# EAGLE design tracker (EAGLE 9.5.2)

## Sheet 1 of 8: Power
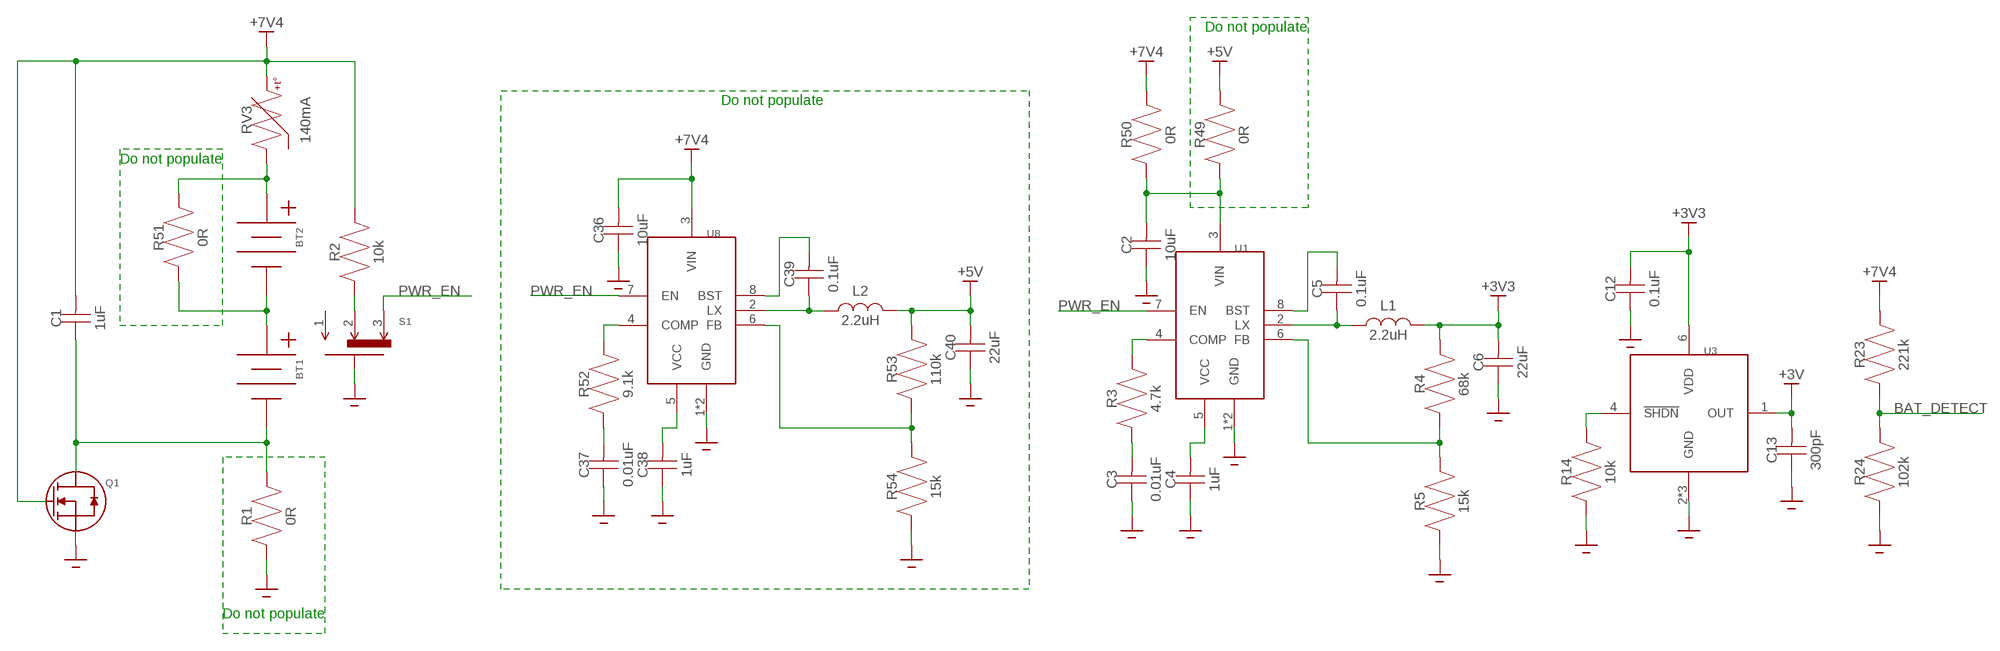
[diagram p0: schematic, sheet 1]

### Parts
BT1  18650  [18650]
BT2  18650  [18650]
C1  1uF  CAPACITOR0603  [0603]
C2  10uF  CAPACITOR0805  [0805]
C3  0.01uF  CAPACITOR0603  [0603]
C4  1uF  CAPACITOR0603  [0603]
C5  0.1uF  CAPACITOR0603  [0603]
C6  22uF  CAPACITOR0805  [0805]
C12  0.1uF  CAPACITOR0603  [0603]
C13  300pF  CAPACITOR0603  [0603]
C36  10uF  CAPACITOR0805  [0805]
C37  0.01uF  CAPACITOR0603  [0603]
C38  1uF  CAPACITOR0603  [0603]
C39  0.1uF  CAPACITOR0603  [0603]
C40  22uF  CAPACITOR0805  [0805]
L1  2.2uH  INDUCTOR0805  [0805]
L2  2.2uH  INDUCTOR0805  [0805]
Q1  DMG2302UK  [DMG2302UK]
R1  0R  RESISTOR0603  [0603]
R2  10k  RESISTOR0603  [0603]
R3  4.7k  RESISTOR0603  [0603]
R4  68k  RESISTOR0603  [0603]
R5  15k  RESISTOR0603  [0603]
R14  10k  RESISTOR0603  [0603]
R23  221k  RESISTOR0603  [0603]
R24  102k  RESISTOR0603  [0603]
R49  0R  RESISTOR0603  [0603]
R50  0R  RESISTOR0603  [0603]
R51  0R  RESISTOR0603  [0603]
R52  9.1k  RESISTOR0603  [0603]
R53  110k  RESISTOR0603  [0603]
R54  15k  RESISTOR0603  [0603]
RV3  140mA  PTC1812  [1812]
S1  OS102011MA1QN1  [OS102011MA1QN1]
U1  AOZ6662DI  [AOZ6662DI]
U3  MCP1501  [SOT95P280X145-6N]
U8  AOZ6662DI  [AOZ6662DI]

### Nets
+3V: C13.P$2 U3.1(OUT) ; also sheet 2
+3V3: C6.P$2 C12.P$2 L1.P$2 R4.P$2 U3.6(VDD) ; also sheet 2,3,4,5,6,7,8
+5V: C40.P$2 L2.P$2 R49.P$2 R53.P$2 ; also sheet 7
+7V4V: C1.P$2 C36.P$2 Q1.1(G) R2.P$2 R23.P$2 R50.P$2 RV3.P$2 U8.3(VIN) ; supply symbol labelled +7V4
BAT_DETECT: R23.P$1 R24.P$2 ; also sheet 2
GND: C2.P$1 C3.P$1 C4.P$1 C6.P$1 C12.P$1 C13.P$1 C36.P$1 C37.P$1 C38.P$1 C40.P$1 Q1.2(S) R1.P$1 R5.P$1 R14.P$1 R24.P$1 R54.P$1 S1.S1(GND) S1.S2(GND) U1.1(GND) U1.9(GND) U3.2(GND) U3.3(GND) U3.5(GND) U8.1(GND) U8.9(GND) ; also sheet 2,3,4,5,6,7,8
N$1: BT1.-1(-) BT1.-2(-) BT1.-3(-) C1.P$1 Q1.3(D) R1.P$2
N$3: R3.P$2 U1.4(COMP)
N$4: BT1.+1(+) BT1.+2(+) BT1.+3(+) BT2.-1(-) BT2.-2(-) BT2.-3(-) R51.P$1
N$5: C3.P$2 R3.P$1
N$6: C4.P$2 U1.5(VCC)
N$7: C5.P$2 U1.8(BST)
N$8: C5.P$1 L1.P$1 U1.2(LX)
N$9: R4.P$1 R5.P$2 U1.6(FB)
N$10: R2.P$1 S1.2
N$12: R14.P$2 U3.4(!SHDN)
N$50: R52.P$2 U8.4(COMP)
N$51: C2.P$2 R49.P$1 R50.P$1 U1.3(VIN)
N$52: C37.P$2 R52.P$1
N$53: C38.P$2 U8.5(VCC)
N$54: C39.P$2 U8.8(BST)
N$55: C39.P$1 L2.P$1 U8.2(LX)
N$56: R53.P$1 R54.P$2 U8.6(FB)
N$58: BT2.+1(+) BT2.+2(+) BT2.+3(+) R51.P$2 RV3.P$1
PWR_EN: S1.3 U1.7(EN) U8.7(EN)
Unconnected: S1.1

### Notes on the sheet
- Do not populate
- Do not populate
- Do not populate
- Do not populate

## Sheet 2 of 8: MCU
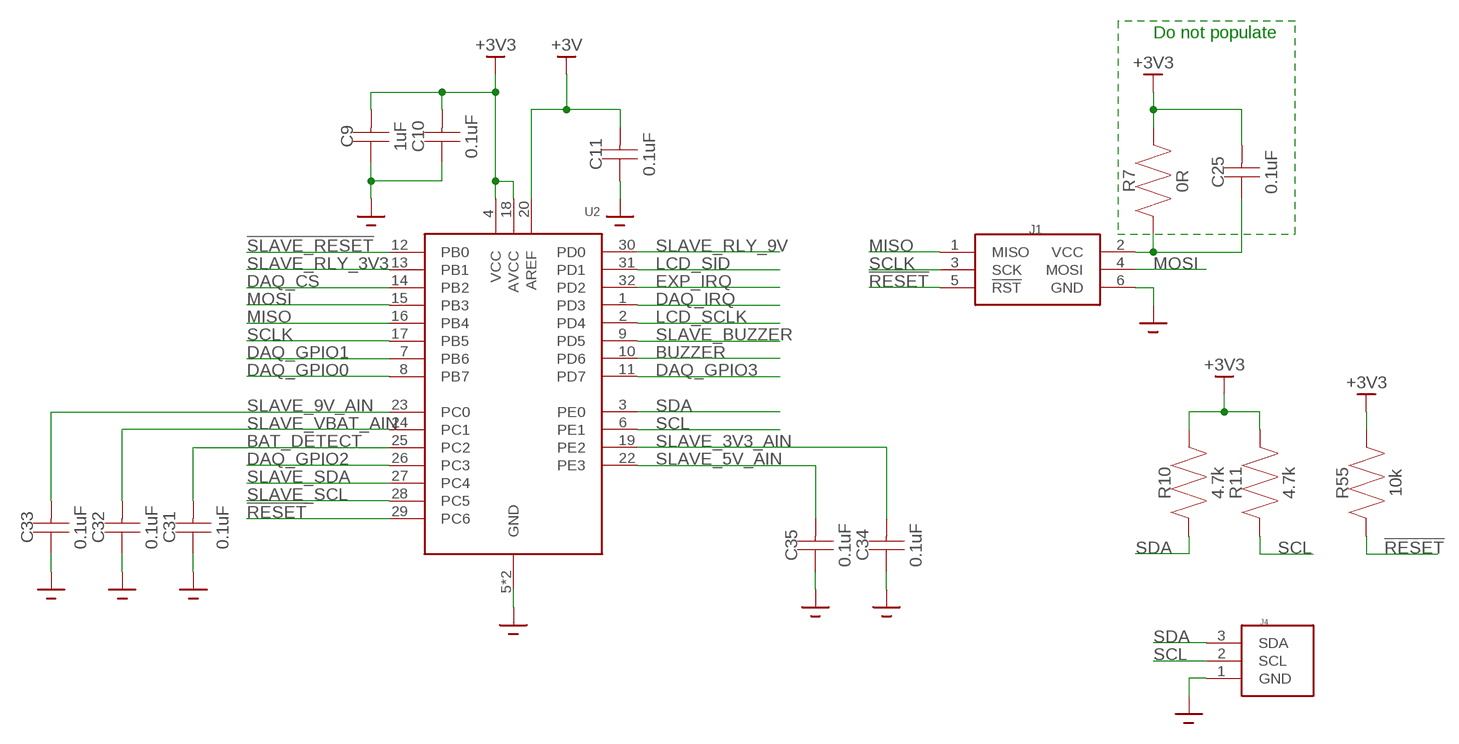
[diagram p1: schematic, sheet 2]

### Parts
C9  1uF  CAPACITOR0603  [0603]
C10  0.1uF  CAPACITOR0603  [0603]
C11  0.1uF  CAPACITOR0603  [0603]
C25  0.1uF  CAPACITOR0603  [0603]
C31  0.1uF  CAPACITOR0603  [0603]
C32  0.1uF  CAPACITOR0603  [0603]
C33  0.1uF  CAPACITOR0603  [0603]
C34  0.1uF  CAPACITOR0603  [0603]
C35  0.1uF  CAPACITOR0603  [0603]
J1  75869-131LF  [75869-131LF]
J4  640456-3  [640456-3]
R7  0R  RESISTOR0603  [0603]
R10  4.7k  RESISTOR0603  [0603]
R11  4.7k  RESISTOR0603  [0603]
R55  10k  RESISTOR0603  [0603]
U2  ATMEGA328PB32-TQFP  [ATMEGA328PB]

### Nets
!RESET: J1.5(!RST) R55.P$1 U2.29(PC6)
!SLAVE_RESET: U2.12(PB0) ; also sheet 3
+3V: C11.P$2 U2.20(AREF) ; also sheet 1
+3V3: C9.P$2 C10.P$2 C25.P$2 R7.P$2 R10.P$2 R11.P$2 R55.P$2 U2.4(VCC) U2.18(AVCC) ; also sheet 1,3,4,5,6,7,8
BAT_DETECT: C31.P$2 U2.25(PC2) ; also sheet 1
BUZZER: U2.10(PD6) ; also sheet 4
DAQ_CS: U2.14(PB2) ; also sheet 5
DAQ_GPIO0: U2.8(PB7) ; also sheet 5
DAQ_GPIO1: U2.7(PB6) ; also sheet 5
DAQ_GPIO2: U2.26(PC3) ; also sheet 5
DAQ_GPIO3: U2.11(PD7) ; also sheet 5
DAQ_IRQ: U2.1(PD3) ; also sheet 5
EXP_IRQ: U2.32(PD2) ; also sheet 6
GND: C9.P$1 C10.P$1 C11.P$1 C31.P$1 C32.P$1 C33.P$1 C34.P$1 C35.P$1 J1.6(GND) J4.1(GND) U2.5(GND) U2.21(GND) ; also sheet 1,3,4,5,6,7,8
LCD_SCLK: U2.2(PD4) ; also sheet 7
LCD_SID: U2.31(PD1) ; also sheet 7
MISO: J1.1(MISO) U2.16(PB4) ; also sheet 3,5
MOSI: J1.4(MOSI) U2.15(PB3) ; also sheet 5
N$14: C25.P$1 J1.2(VCC) R7.P$1
SCL: J4.2(SCL) R11.P$1 U2.6(PE1) ; also sheet 6,8
SCLK: J1.3(SCK) U2.17(PB5) ; also sheet 5
SDA: J4.3(SDA) R10.P$1 U2.3(PE0) ; also sheet 6,8
SLAVE_3V3_AIN: C34.P$2 U2.19(PE2) ; also sheet 3
SLAVE_5V_AIN: C35.P$2 U2.22(PE3) ; also sheet 3
SLAVE_9V_AIN: C33.P$2 U2.23(PC0) ; also sheet 3
SLAVE_BUZZER: U2.9(PD5) ; also sheet 3
SLAVE_RLY_3V3: U2.13(PB1) ; also sheet 3
SLAVE_RLY_9V: U2.30(PD0) ; also sheet 3
SLAVE_SCL: U2.28(PC5) ; also sheet 3
SLAVE_SDA: U2.27(PC4) ; also sheet 3
SLAVE_VBAT_AIN: C32.P$2 U2.24(PC1) ; also sheet 3

### Notes on the sheet
- Do not populate

## Sheet 3 of 8: Slave Port
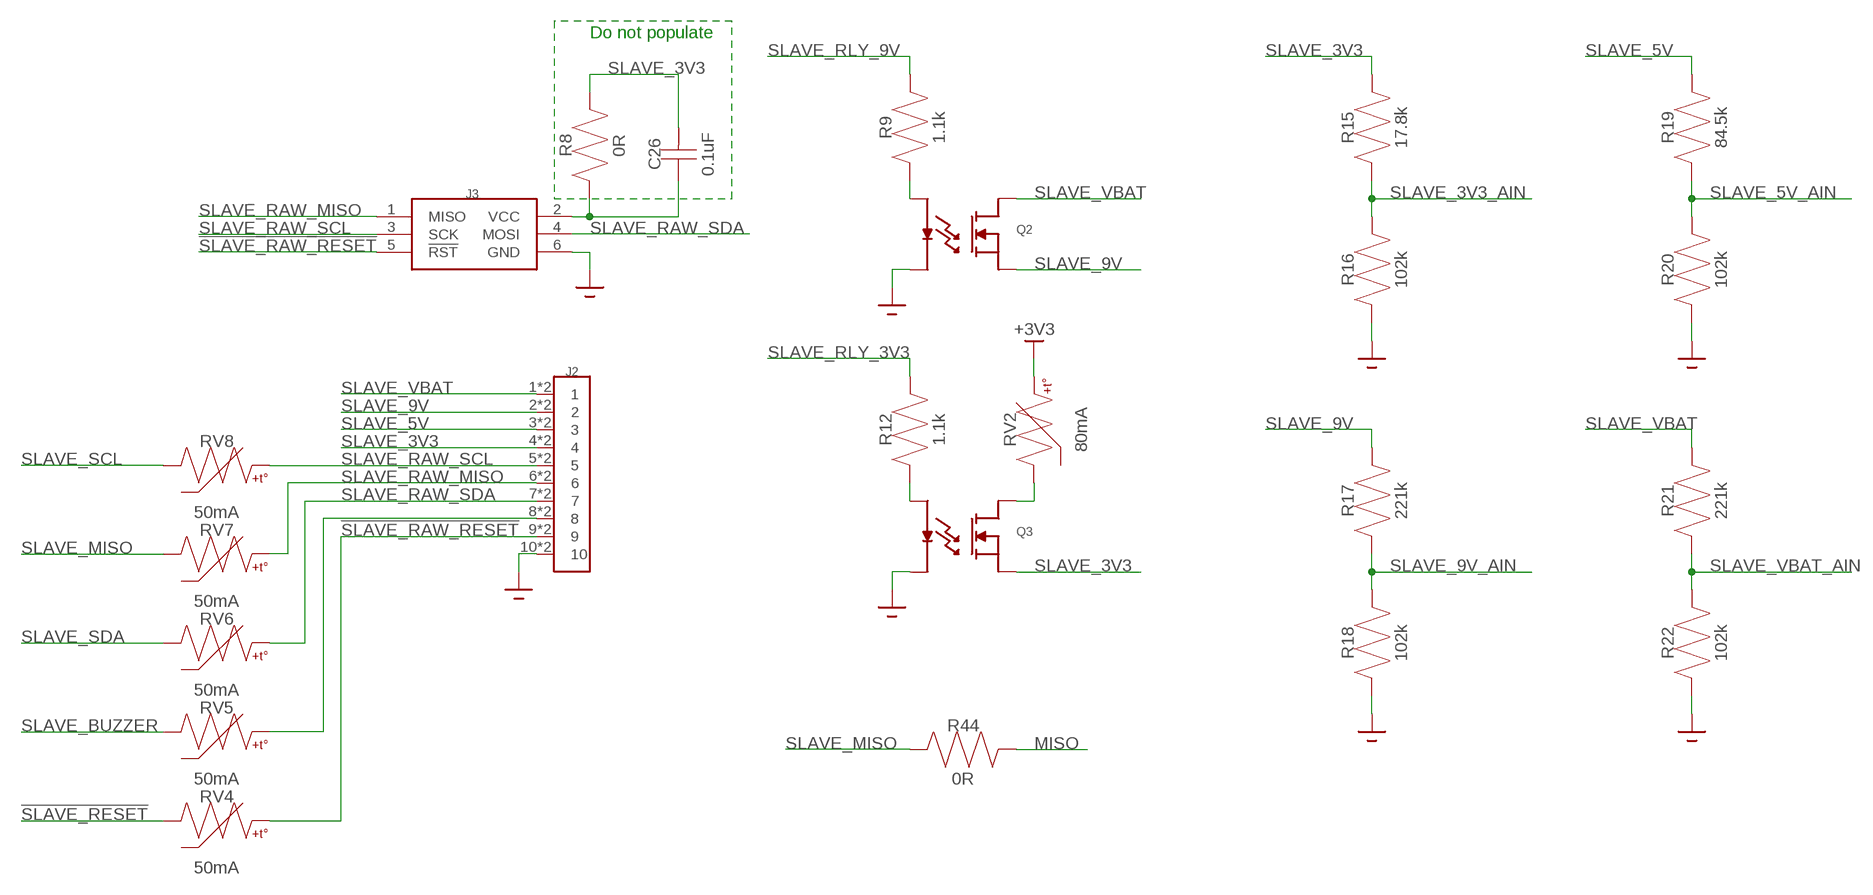
[diagram p2: schematic, sheet 3]

### Parts
C26  0.1uF  CAPACITOR0603  [0603]
J2  5-5530843-0FEMALE  [5-5530843-0]
J3  75869-131LF  [75869-131LF]
Q2  CPC1002N  [CPC1002N]
Q3  CPC1002N  [CPC1002N]
R8  0R  RESISTOR0603  [0603]
R9  1.1k  RESISTOR0603  [0603]
R12  1.1k  RESISTOR0603  [0603]
R15  17.8k  RESISTOR0603  [0603]
R16  102k  RESISTOR0603  [0603]
R17  221k  RESISTOR0603  [0603]
R18  102k  RESISTOR0603  [0603]
R19  84.5k  RESISTOR0603  [0603]
R20  102k  RESISTOR0603  [0603]
R21  221k  RESISTOR0603  [0603]
R22  102k  RESISTOR0603  [0603]
R44  0R  RESISTOR0603  [0603]
RV2  80mA  PTC0603  [0603]
RV4  50mA  PTC0603  [0603]
RV5  50mA  PTC0603  [0603]
RV6  50mA  PTC0603  [0603]
RV7  50mA  PTC0603  [0603]
RV8  50mA  PTC0603  [0603]

### Nets
!SLAVE_RAW_RESET: J2.9 J2.19 J3.5(!RST) RV4.P$2
!SLAVE_RESET: RV4.P$1 ; also sheet 2
+3V3: RV2.P$2 ; also sheet 1,2,4,5,6,7,8
GND: J2.10 J2.20 J3.6(GND) Q2.2(C-) Q3.2(C-) R16.P$1 R18.P$1 R20.P$1 R22.P$1 ; also sheet 1,2,4,5,6,7,8
MISO: R44.P$2 ; also sheet 2,5
N$2: Q3.4(DC+) RV2.P$1
N$19: C26.P$1 J3.2(VCC) R8.P$1
N$20: Q3.1(C+) R12.P$1
N$26: Q2.1(C+) R9.P$1
N$64: J2.8 J2.18 RV5.P$2
SLAVE_3V3: C26.P$2 J2.4 J2.14 Q3.3(DC-) R8.P$2 R15.P$2
SLAVE_3V3_AIN: R15.P$1 R16.P$2 ; also sheet 2
SLAVE_5V: J2.3 J2.13 R19.P$2
SLAVE_5V_AIN: R19.P$1 R20.P$2 ; also sheet 2
SLAVE_9V: J2.2 J2.12 Q2.3(DC-) R17.P$2
SLAVE_9V_AIN: R17.P$1 R18.P$2 ; also sheet 2
SLAVE_BUZZER: RV5.P$1 ; also sheet 2
SLAVE_MISO: R44.P$1 RV7.P$1
SLAVE_RAW_MISO: J2.6 J2.16 J3.1(MISO) RV7.P$2
SLAVE_RAW_SCL: J2.5 J2.15 J3.3(SCK) RV8.P$2
SLAVE_RAW_SDA: J2.7 J2.17 J3.4(MOSI) RV6.P$2
SLAVE_RLY_3V3: R12.P$2 ; also sheet 2
SLAVE_RLY_9V: R9.P$2 ; also sheet 2
SLAVE_SCL: RV8.P$1 ; also sheet 2
SLAVE_SDA: RV6.P$1 ; also sheet 2
SLAVE_VBAT: J2.1 J2.11 Q2.4(DC+) R21.P$2
SLAVE_VBAT_AIN: R21.P$1 R22.P$2 ; also sheet 2

### Notes on the sheet
- Do not populate

## Sheet 4 of 8: Buzzer and LEDs
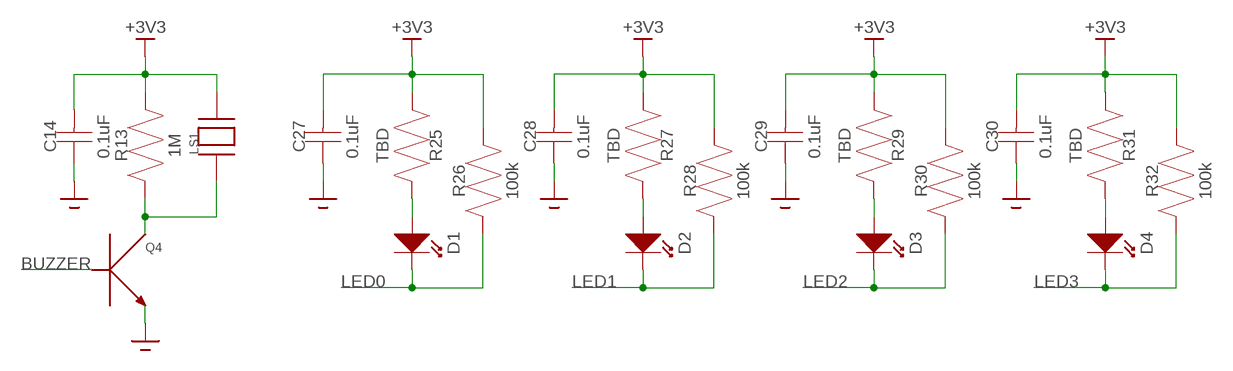
[diagram p3: schematic, sheet 4]

### Parts
C14  0.1uF  CAPACITOR0603  [0603]
C27  0.1uF  CAPACITOR0603  [0603]
C28  0.1uF  CAPACITOR0603  [0603]
C29  0.1uF  CAPACITOR0603  [0603]
C30  0.1uF  CAPACITOR0603  [0603]
D1  LED  [0805]
D2  LED  [0805]
D3  LED  [0805]
D4  LED  [0805]
LS1  AT-1224-TWT-5V-2-R  [AT-1224-TWT-5V-2-R]
Q4  MMBT3904  [MMBT3904]
R13  1M  RESISTOR0603  [0603]
R25  TBD  RESISTOR0603  [0603]
R26  100k  RESISTOR0603  [0603]
R27  TBD  RESISTOR0603  [0603]
R28  100k  RESISTOR0603  [0603]
R29  TBD  RESISTOR0603  [0603]
R30  100k  RESISTOR0603  [0603]
R31  TBD  RESISTOR0603  [0603]
R32  100k  RESISTOR0603  [0603]

### Nets
+3V3: C14.P$2 C27.P$2 C28.P$2 C29.P$2 C30.P$2 LS1.2 R13.P$2 R25.P$1 R26.P$2 R27.P$1 R28.P$2 R29.P$1 R30.P$2 R31.P$1 R32.P$2 ; also sheet 1,2,3,5,6,7,8
BUZZER: Q4.1(B) ; also sheet 2
GND: C14.P$1 C27.P$1 C28.P$1 C29.P$1 C30.P$1 Q4.2(E) ; also sheet 1,2,3,5,6,7,8
LED0: D1.P$2(OUT) R26.P$1 ; also sheet 6
LED1: D2.P$2(OUT) R28.P$1 ; also sheet 6
LED2: D3.P$2(OUT) R30.P$1 ; also sheet 6
LED3: D4.P$2(OUT) R32.P$1 ; also sheet 6
N$13: D2.P$1(IN) R27.P$2
N$15: D3.P$1(IN) R29.P$2
N$16: D1.P$1(IN) R25.P$2
N$17: D4.P$1(IN) R31.P$2
N$27: LS1.1 Q4.3(C) R13.P$1

## Sheet 5 of 8: RF
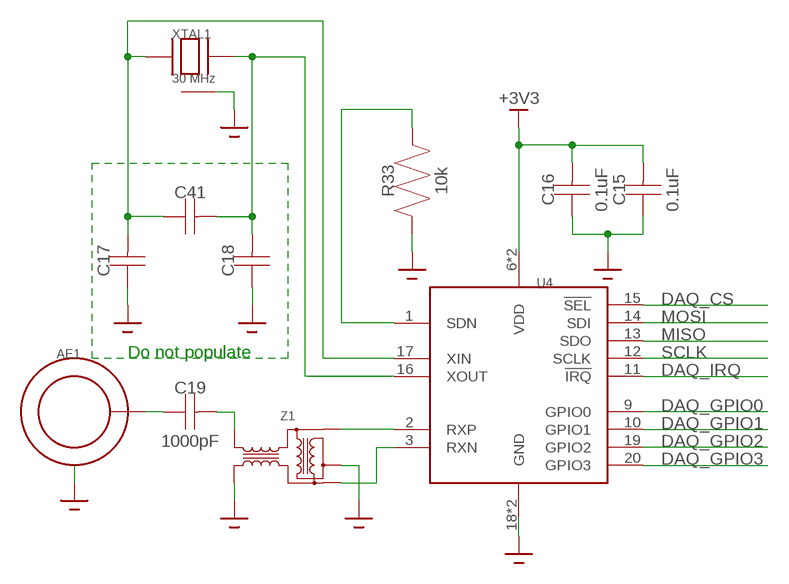
[diagram p4: schematic, sheet 5]

### Parts
AE1  CON-SMA-EDGE-S  [CON-SMA-EDGE-S]
C15  0.1uF  CAPACITOR0603  [0603]
C16  0.1uF  CAPACITOR0603  [0603]
C17  CAPACITOR0603  [0603]
C18  CAPACITOR0603  [0603]
C19  1000pF  CAPACITOR0402  [0402]
C41  CAPACITOR0603  [0603]
R33  10k  RESISTOR0603  [0603]
U4  SI4362  [SI4362]
XTAL1  30 MHz  RH100  [RH100]
Z1  TC1-1T-152X+  [TC1-1T-152X+]

### Nets
+3V3: C15.P$2 C16.P$2 U4.6(VDD) U4.8(VDD) ; also sheet 1,2,3,4,6,7,8
DAQ_CS: U4.15(!SEL) ; also sheet 2
DAQ_GPIO0: U4.9(GPIO0) ; also sheet 2
DAQ_GPIO1: U4.10(GPIO1) ; also sheet 2
DAQ_GPIO2: U4.19(GPIO2) ; also sheet 2
DAQ_GPIO3: U4.20(GPIO3) ; also sheet 2
DAQ_IRQ: U4.11(!IRQ) ; also sheet 2
GND: AE1.GND1(GND) AE1.GND2(GND) AE1.GND3(GND) AE1.GND4(GND) C15.P$1 C16.P$1 C17.P$1 C18.P$1 R33.P$1 U4.18(GND) U4.21(GND) XTAL1.1(GND) XTAL1.3(GND) Z1.2(CENTER) Z1.4(GND) ; also sheet 1,2,3,4,6,7,8
MISO: U4.13(SDO) ; also sheet 2,3
MOSI: U4.14(SDI) ; also sheet 2
N$18: R33.P$2 U4.1(SDN)
N$21: AE1.CENTER(OUT) C19.1
N$23: C17.P$2 C41.P$1 U4.17(XIN) XTAL1.2
N$24: U4.3(RXN) Z1.3(BAL2)
N$25: U4.2(RXP) Z1.1(BAL1)
N$28: C18.P$2 C41.P$2 U4.16(XOUT) XTAL1.4
N$29: C19.2 Z1.6(UNBAL)
SCLK: U4.12(SCLK) ; also sheet 2

### Notes on the sheet
- Do not populate

## Sheet 6 of 8: Pin Pad
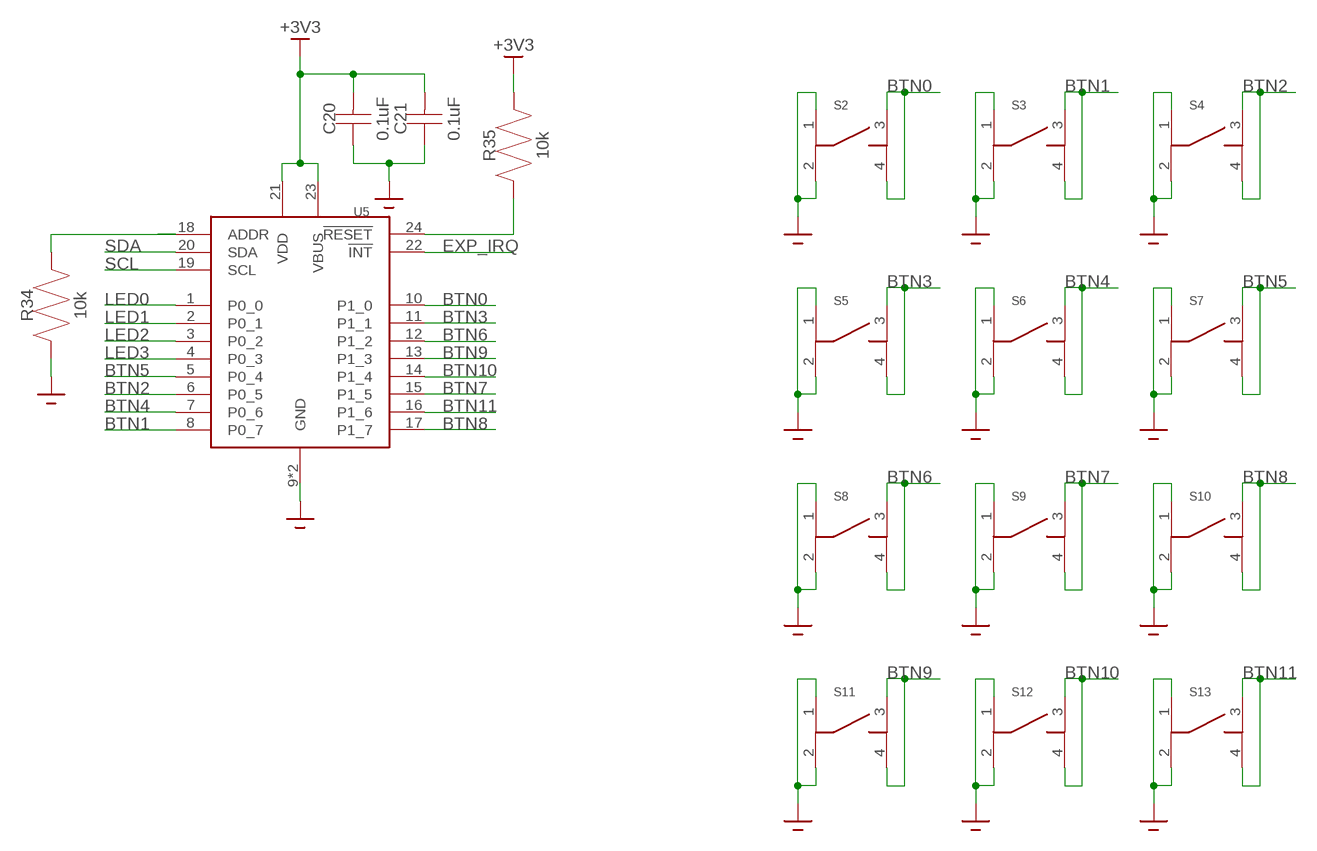
[diagram p5: schematic, sheet 6]

### Parts
C20  0.1uF  CAPACITOR0603  [0603]
C21  0.1uF  CAPACITOR0603  [0603]
R34  10k  RESISTOR0603  [0603]
R35  10k  RESISTOR0603  [0603]
S2  3-1825910  [3-1825910]
S3  3-1825910  [3-1825910]
S4  3-1825910  [3-1825910]
S5  3-1825910  [3-1825910]
S6  3-1825910  [3-1825910]
S7  3-1825910  [3-1825910]
S8  3-1825910  [3-1825910]
S9  3-1825910  [3-1825910]
S10  3-1825910  [3-1825910]
S11  3-1825910  [3-1825910]
S12  3-1825910  [3-1825910]
S13  3-1825910  [3-1825910]
U5  PCAL6416  [PCAL6416]

### Nets
+3V3: C20.P$2 C21.P$2 R35.P$2 U5.21(VDD) U5.23(VBUS) ; also sheet 1,2,3,4,5,7,8
BTN0: S2.3 S2.4 U5.10(P1_0)
BTN1: S3.3 S3.4 U5.8(P0_7)
BTN2: S4.3 S4.4 U5.6(P0_5)
BTN3: S5.3 S5.4 U5.11(P1_1)
BTN4: S6.3 S6.4 U5.7(P0_6)
BTN5: S7.3 S7.4 U5.5(P0_4)
BTN6: S8.3 S8.4 U5.12(P1_2)
BTN7: S9.3 S9.4 U5.15(P1_5)
BTN8: S10.3 S10.4 U5.17(P1_7)
BTN9: S11.3 S11.4 U5.13(P1_3)
BTN10: S12.3 S12.4 U5.14(P1_4)
BTN11: S13.3 S13.4 U5.16(P1_6)
EXP_IRQ: U5.22(!INT) ; also sheet 2
GND: C20.P$1 C21.P$1 R34.P$1 S2.1 S2.2 S3.1 S3.2 S4.1 S4.2 S5.1 S5.2 S6.1 S6.2 S7.1 S7.2 S8.1 S8.2 S9.1 S9.2 S10.1 S10.2 S11.1 S11.2 S12.1 S12.2 S13.1 S13.2 U5.9(GND) U5.25(GND) ; also sheet 1,2,3,4,5,7,8
LED0: U5.1(P0_0) ; also sheet 4
LED1: U5.2(P0_1) ; also sheet 4
LED2: U5.3(P0_2) ; also sheet 4
LED3: U5.4(P0_3) ; also sheet 4
N$30: R35.P$1 U5.24(!RESET)
N$32: R34.P$2 U5.18(ADDR)
SCL: U5.19(SCL) ; also sheet 2,8
SDA: U5.20(SDA) ; also sheet 2,8

## Sheet 7 of 8: LCD
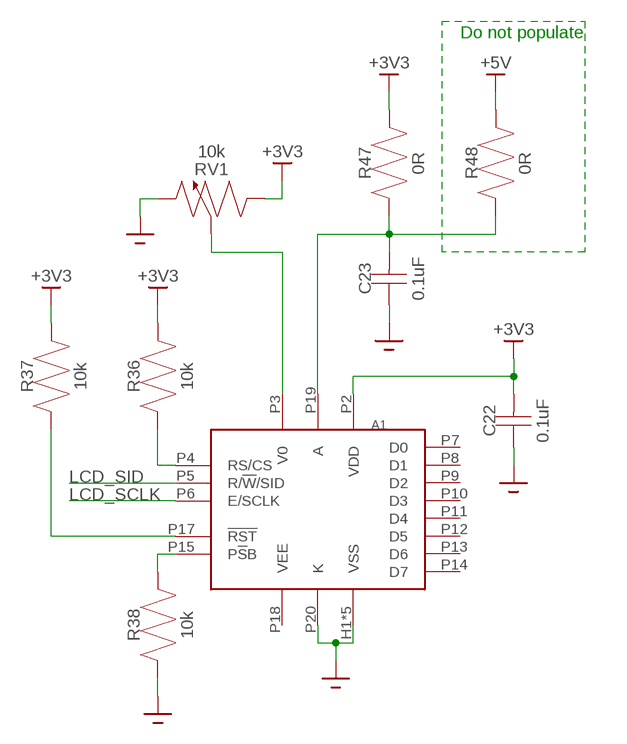
[diagram p6: schematic, sheet 7]

### Parts
A1  LCD12864  [LCD12864]
C22  0.1uF  CAPACITOR0603  [0603]
C23  0.1uF  CAPACITOR0603  [0603]
R36  10k  RESISTOR0603  [0603]
R37  10k  RESISTOR0603  [0603]
R38  10k  RESISTOR0603  [0603]
R47  0R  RESISTOR0603  [0603]
R48  0R  RESISTOR0603  [0603]
RV1  10k  TC33X-2  [TC33X-2]

### Nets
+3V3: A1.P2(VDD) C22.P$2 R36.P$2 R37.P$2 R47.P$2 RV1.1(CCW) ; also sheet 1,2,3,4,5,6,8
+5V: R48.P$2 ; also sheet 1
GND: A1.H1(VSS) A1.H2(VSS) A1.H3(VSS) A1.H4(VSS) A1.P1(VSS) A1.P20(K) C22.P$1 C23.P$1 R38.P$1 RV1.3(CW) ; also sheet 1,2,3,4,5,6,8
LCD_SCLK: A1.P6(E/SCLK) ; also sheet 2
LCD_SID: A1.P5(R/!W!/SID) ; also sheet 2
N$22: A1.P4(RS/CS) R36.P$1
N$31: A1.P17(!RST) R37.P$1
N$33: A1.P15(P!S!B) R38.P$2
N$35: A1.P3(V0) RV1.2(WIPER)
N$43: A1.P19(A) C23.P$2 R47.P$1 R48.P$1
Unconnected: A1.P7(D0) A1.P8(D1) A1.P9(D2) A1.P10(D3) A1.P11(D4) A1.P12(D5) A1.P13(D6) A1.P14(D7)

### Notes on the sheet
- Do not populate

## Sheet 8 of 8: EEPROM
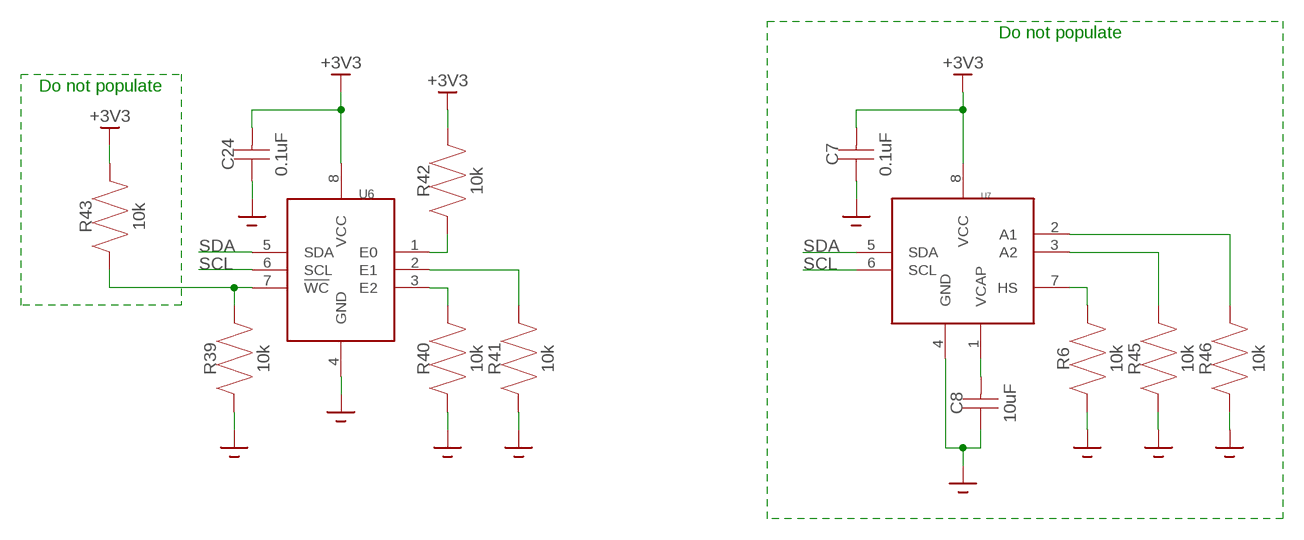
[diagram p7: schematic, sheet 8]

### Parts
C7  0.1uF  CAPACITOR0603  [0603]
C8  10uF  CAPACITOR0805  [0805]
C24  0.1uF  CAPACITOR0603  [0603]
R6  10k  RESISTOR0603  [0603]
R39  10k  RESISTOR0603  [0603]
R40  10k  RESISTOR0603  [0603]
R41  10k  RESISTOR0603  [0603]
R42  10k  RESISTOR0603  [0603]
R43  10k  RESISTOR0603  [0603]
R45  10k  RESISTOR0603  [0603]
R46  10k  RESISTOR0603  [0603]
U6  M24  [M24]
U7  47L16  [47L16]

### Nets
+3V3: C7.P$2 C24.P$2 R42.P$2 R43.P$2 U6.8(VCC) U7.8(VCC) ; also sheet 1,2,3,4,5,6,7
GND: C7.P$1 C8.P$1 C24.P$1 R6.P$1 R39.P$1 R40.P$1 R41.P$1 R45.P$1 R46.P$1 U6.4(GND) U7.4(GND) ; also sheet 1,2,3,4,5,6,7
N$11: R42.P$1 U6.1(E0)
N$34: R39.P$2 R43.P$1 U6.7(!WC)
N$36: R40.P$2 U6.3(E2)
N$37: R41.P$2 U6.2(E1)
N$38: R6.P$2 U7.7(HS)
N$44: C8.P$2 U7.1(VCAP)
N$45: R45.P$2 U7.3(A2)
N$46: R46.P$2 U7.2(A1)
SCL: U6.6(SCL) U7.6(SCL) ; also sheet 2,6
SDA: U6.5(SDA) U7.5(SDA) ; also sheet 2,6

### Notes on the sheet
- Do not populate
- Do not populate

## Power pins joined to a net without a drawn wire
VEE: A1.P18(VEE)

## Library data of the parts
A1 = radio-tracker:LCD12864
AE1 = radio-tracker:CON-SMA-EDGE-S
BT1 BT2 = radio-tracker:18650
C1-C41 = radio-tracker:CAPACITOR
D1-D4 = radio-tracker:LED
J1 J3 = radio-tracker:75869-131LF
J2 = radio-tracker:5-5530843-0
J4 = radio-tracker:640456-3
L1 L2 = radio-tracker:INDUCTOR
LS1 = radio-tracker:AT-1224-TWT-5V-2-R
Q1 = radio-tracker:DMG2302UK
Q2 Q3 = radio-tracker:CPC1002N
Q4 = radio-tracker:MMBT3904
R1-R55 = radio-tracker:RESISTOR
RV1 = radio-tracker:TC33X-2
RV2-RV8 = radio-tracker:PTC
S1 = radio-tracker:OS102011MA1QN1
S2-S13 = radio-tracker:3-1825910
U1 U8 = radio-tracker:AOZ6662DI
U2 = radio-tracker:ATMEGA328PB
U3 = radio-tracker:MCP1501
U4 = radio-tracker:SI4362
U5 = radio-tracker:PCAL6416
U6 = radio-tracker:M24
U7 = radio-tracker:47L16
XTAL1 = radio-tracker:RH100
Z1 = radio-tracker:TC1-1T-152X+

## Board
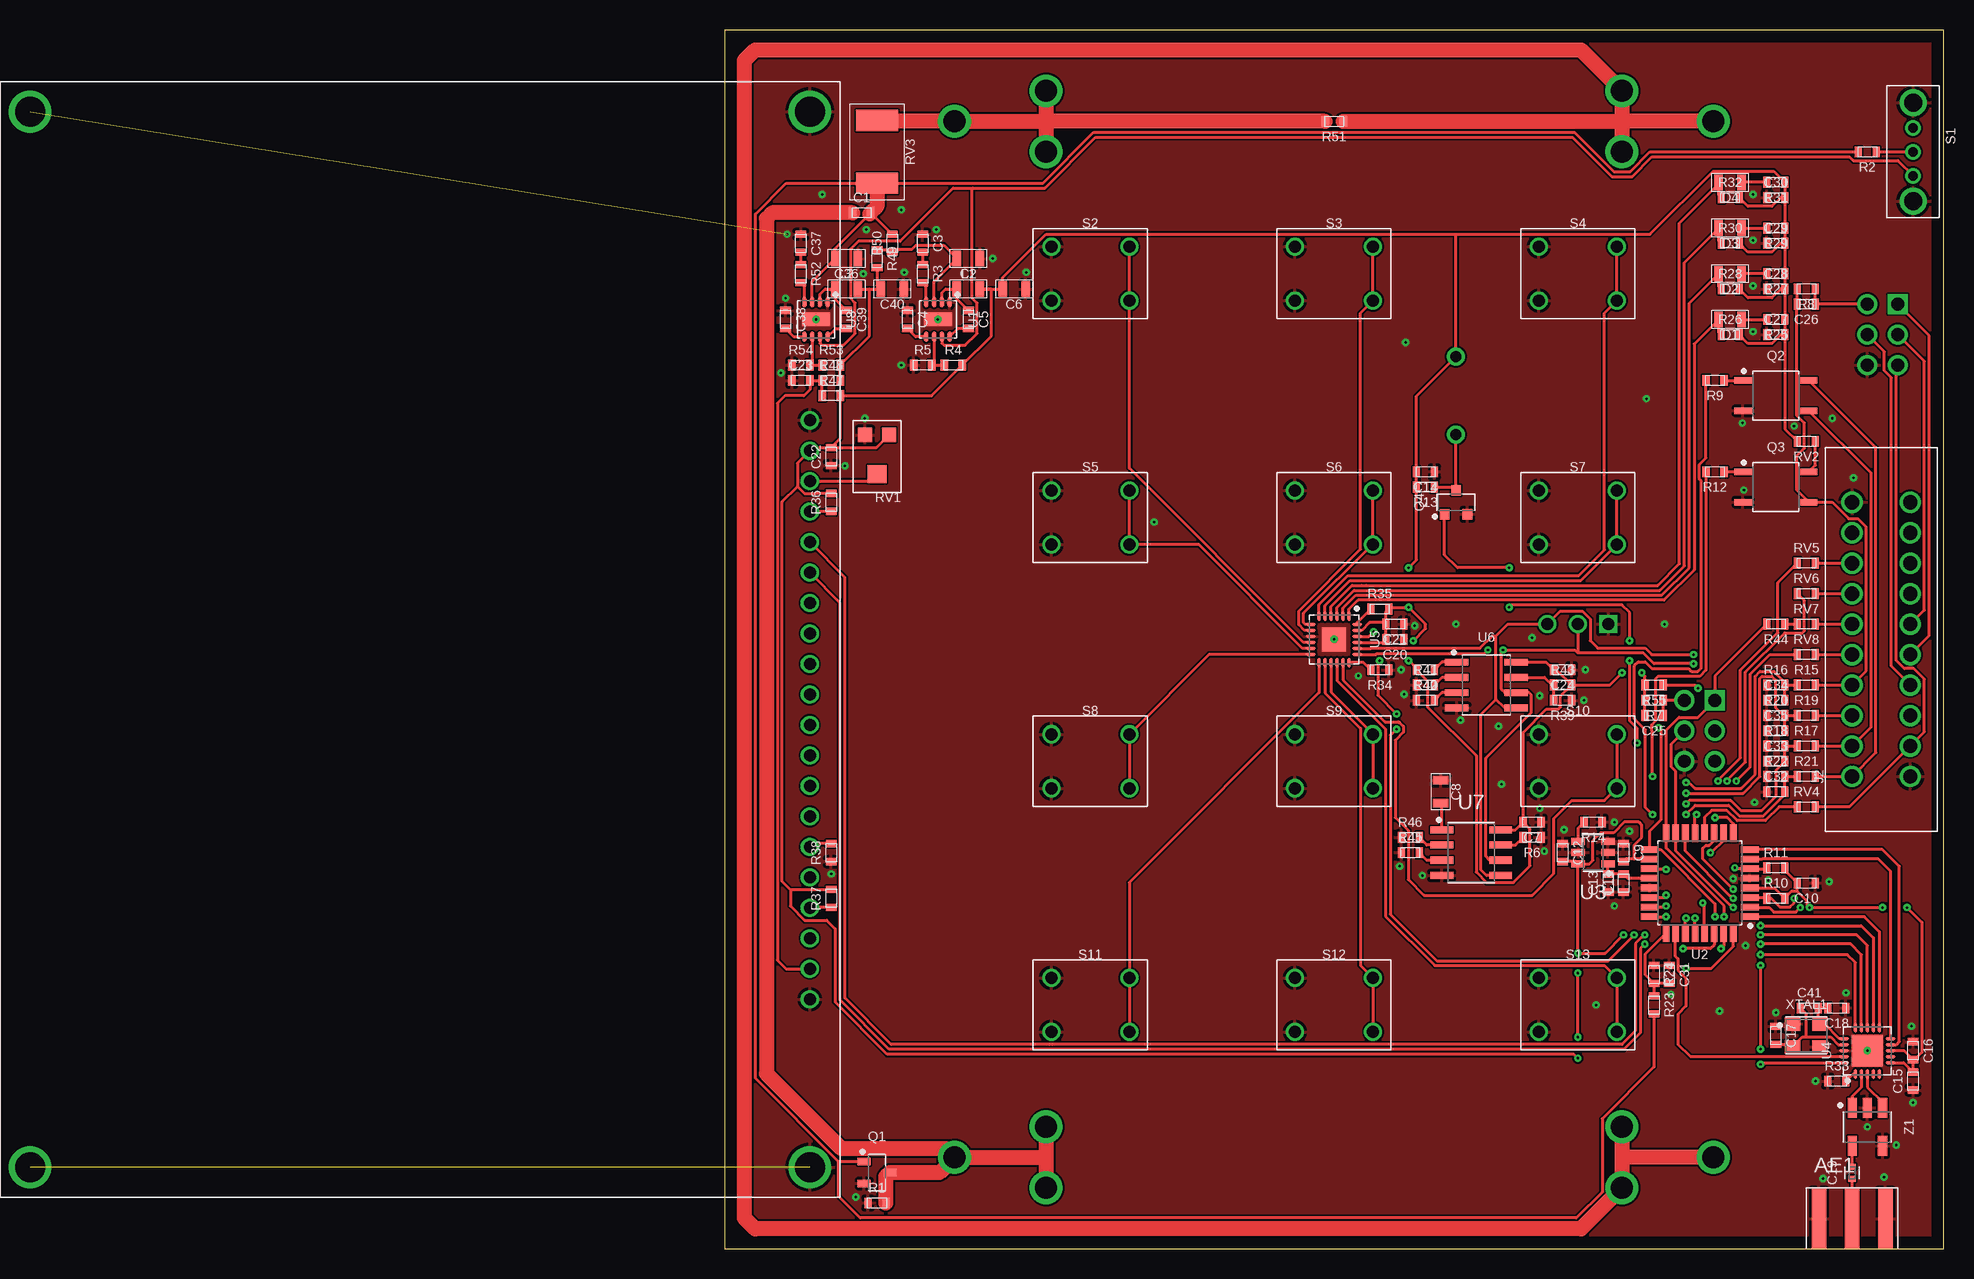
[diagram p8: board, top side]
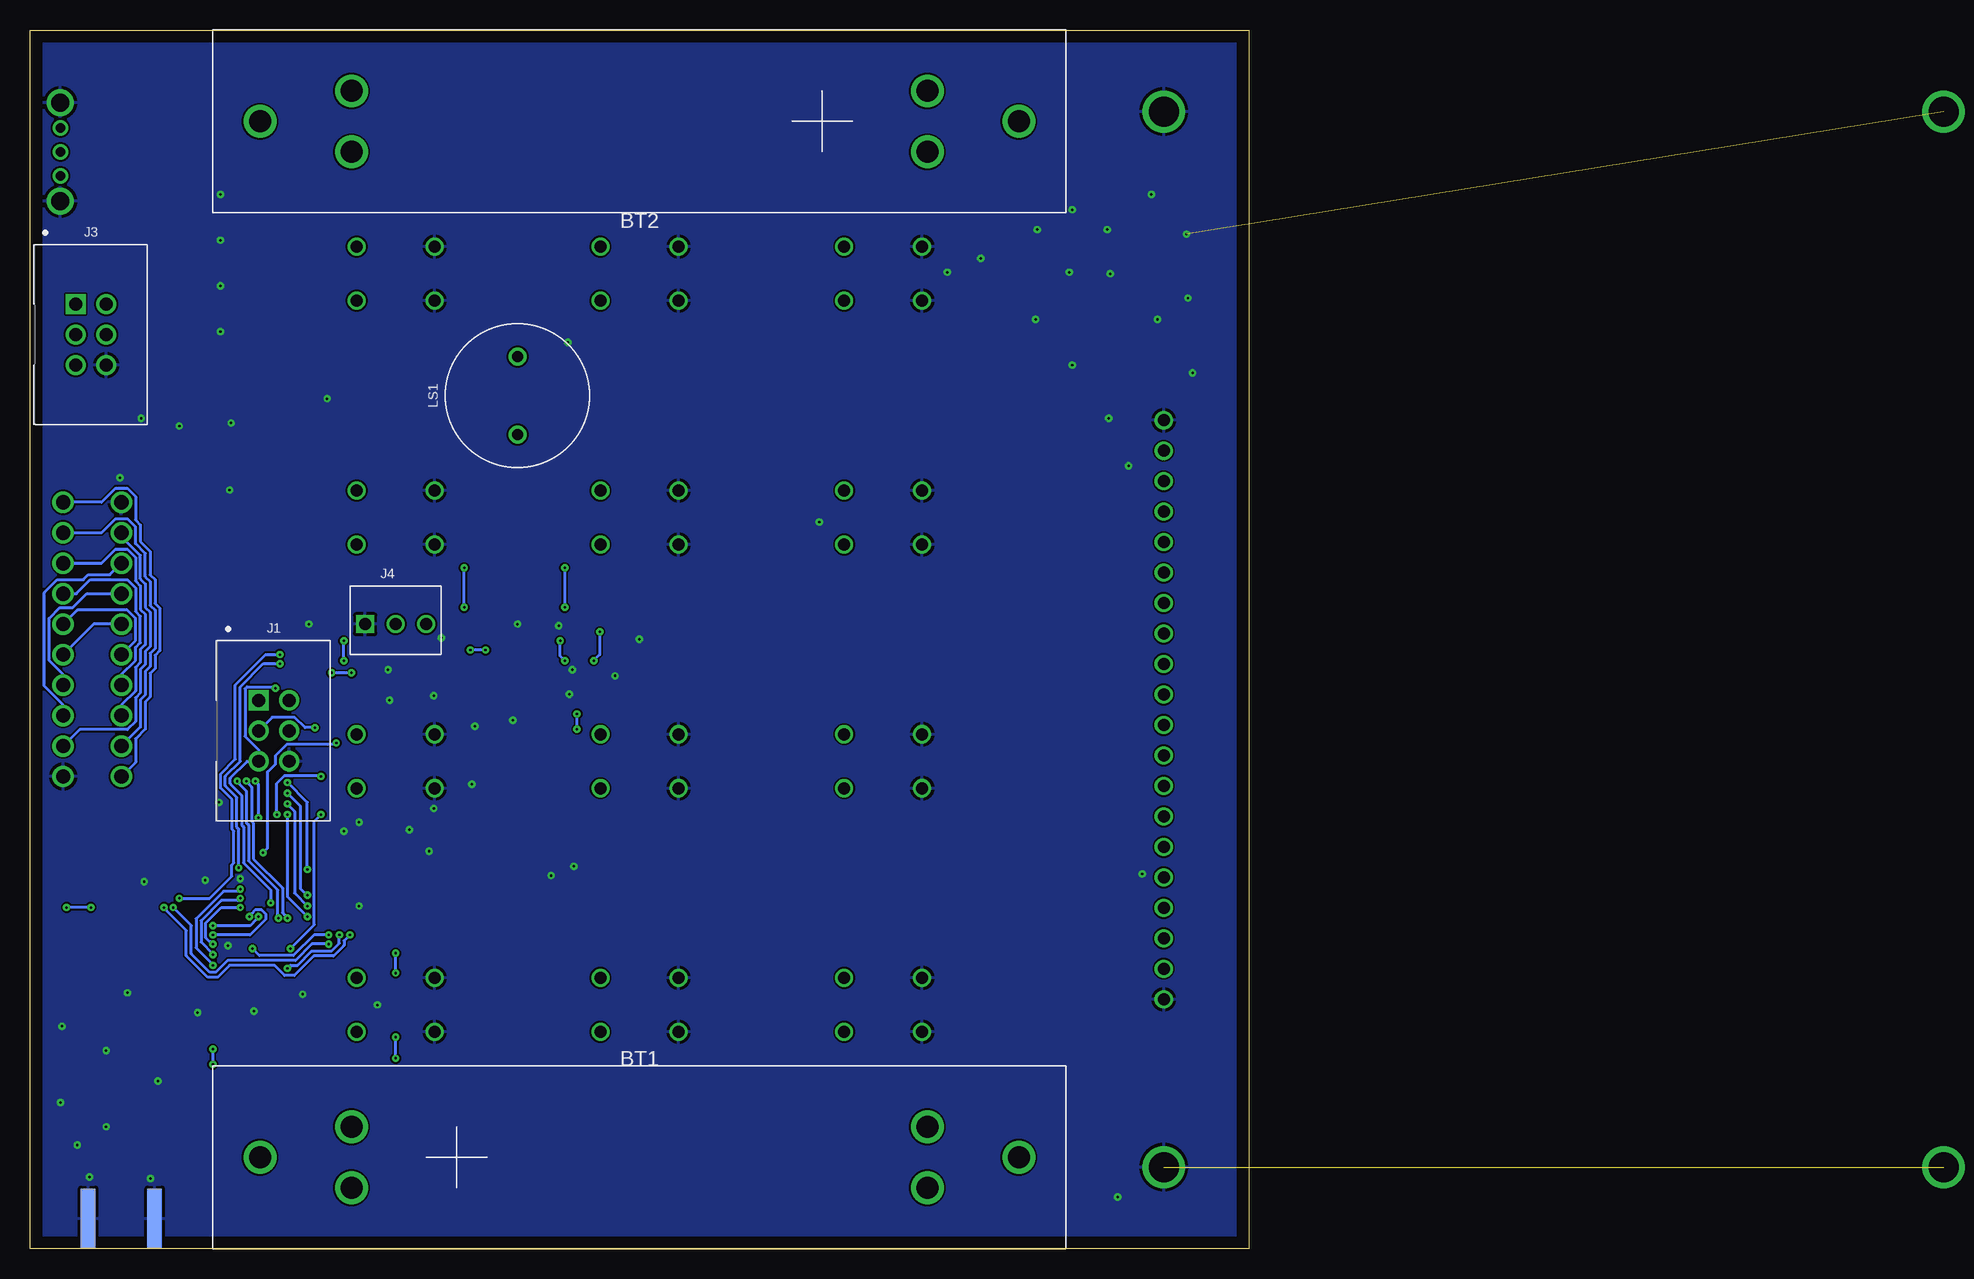
[diagram p9: board, bottom side, seen from below]

Size 101.6 x 101.6 mm. Coordinates in mm from the lower left corner, seen from the top.
Outline: 0,0 101.6,0 101.6,101.6 0,101.6 0,0
Copper layers (1*16): Top 0.035mm / dielectric 1.5mm / Bottom 0.035mm
Design rules "default *": minimum track width 6mil, minimum drill 0.2mm, track to track 6mil, track to pad 6mil, pad to pad 6mil, via to via 6mil, smd to smd 6mil, copper to edge 40mil, drill to drill 6mil, minimum pad ring 10mil, minimum via ring 8mil, stop-mask expansion 4mil, vias tented up to drill 0mil, thermal gap 10mil

### Footprints (pad centres in the part's own frame; a part is rotated, then mirrored left to right if it is on the bottom)
LCD12864 = drill 2.5: H1 -44,32.5; H2 44,32.5; H3 -44,-32.5; H4 44,-32.5 | drill 1: P1 18.26,-32.5; P2 15.72,-32.5; P3 13.18,-32.5; P4 10.64,-32.5; P5 8.1,-32.5; P6 5.56,-32.5; P7 3.02,-32.5; P8 0.48,-32.5; P9 -2.06,-32.5; P10 -4.6,-32.5; P11 -7.14,-32.5; P12 -9.68,-32.5; P13 -12.22,-32.5; P14 -14.76,-32.5; P15 -17.3,-32.5; P16 -19.84,-32.5; P17 -22.38,-32.5; P18 -24.92,-32.5; P19 -27.46,-32.5; P20 -30,-32.5
CON-SMA-EDGE-S = smd 5 x 1.2: CENTER -2.5,0; GND1 -2.5,2.77; GND2 -2.5,-2.77 | smd 5 x 1.2 bottom: GND3 -2.5,2.77; GND4 -2.5,-2.77
18650 = drill 1.829: +1 -24.003,2.54; +2 -24.003,-2.54; +3 -31.623,0; -1 24.003,2.54; -2 24.003,-2.54; -3 31.623,0
0603 = smd 0.6 x 0.9: P$1 -0.75,0; P$2 0.75,0
0805 = smd 0.711 x 1.295: P$1 -0.953,0; P$2 0.953,0
0402 = smd 0.5 x 0.6: 1 -0.5,0; 2 0.5,0
75869-131LF = drill 1.077 pad 1.677 square: 1 -1.27,2.54 | drill 1.077 pad 1.677: 2 1.27,2.54; 3 -1.27,0; 4 1.27,0; 5 -1.27,-2.54; 6 1.27,-2.54
5-5530843-0 = drill 1.19 pad 1.79: 1 0,0; 2 2.54,0; 3 5.08,0; 4 7.62,0; 5 10.16,0; 6 12.7,0; 7 15.24,0; 8 17.78,0; 9 20.32,0; 10 22.86,0; 11 22.86,-4.85; 12 20.32,-4.85; 13 17.78,-4.85; 14 15.24,-4.85; 15 12.7,-4.85; 16 10.16,-4.85; 17 7.62,-4.85; 18 5.08,-4.85; 19 2.54,-4.85; 20 0,-4.85
640456-3 = drill 1 square: 1 -2.54,0 | drill 1: 2 0,0; 3 2.54,0
AT-1224-TWT-5V-2-R = drill 0.9 pad 1.5: 1 -3.25,0; 2 3.25,0
DMG2302UK = smd 1.088 x 0.609: 1 -1.07,0.915; 2 -1.07,-0.915; 3 1.07,0
CPC1002N = smd 1.435 x 0.538: 1 -2.746,1.27; 2 -2.746,-1.27; 3 2.746,-1.27; 4 2.746,1.27
MMBT3904 = smd 0.9 x 0.8: 1 -1,0.95; 2 -1,-0.95; 3 1,0
TC33X-2 = smd 1.2 x 1.2: 1 -1,-1.8; 3 1,-1.8 | smd 1.6 x 1.5: 2 0,1.45
1812 = smd 1.78 x 3.5: P$1 -2.615,0; P$2 2.615,0
OS102011MA1QN1 = drill 0.8: 1 -2,0; 2 0,0; 3 2,0 | drill 1.5: S1 -4.1,0; S2 4.1,0
3-1825910 = drill 1: 1 -3.25,2.25; 2 -3.25,-2.25; 3 3.25,2.25; 4 3.25,-2.25
AOZ6662DI = smd 0.86 x 0.317: 1 -1.435,0.975; 2 -1.435,0.325; 3 -1.435,-0.325; 4 -1.435,-0.975; 5 1.435,-0.975; 6 1.435,-0.325; 7 1.435,0.325; 8 1.435,0.975 | smd 1.15 x 2.35: 9 0,0
ATMEGA328PB = smd 1.469 x 0.547: 1 -4.171,2.8; 2 -4.171,2; 3 -4.171,1.2; 4 -4.171,0.4; 5 -4.171,-0.4; 6 -4.171,-1.2; 7 -4.171,-2; 8 -4.171,-2.8; 17 4.171,-2.8; 18 4.171,-2; 19 4.171,-1.2; 20 4.171,-0.4; 21 4.171,0.4; 22 4.171,1.2; 23 4.171,2; 24 4.171,2.8 | smd 0.547 x 1.469: 9 -2.8,-4.171; 10 -2,-4.171; 11 -1.2,-4.171; 12 -0.4,-4.171; 13 0.4,-4.171; 14 1.2,-4.171; 15 2,-4.171; 16 2.8,-4.171; 25 2.8,4.171; 26 2,4.171; 27 1.2,4.171; 28 0.4,4.171; 29 -0.4,4.171; 30 -1.2,4.171; 31 -2,4.171; 32 -2.8,4.171
SOT95P280X145-6N = smd 1.119 x 0.59: 1 -1.246,0.95; 2 -1.246,0; 3 -1.246,-0.95; 4 1.246,-0.95; 5 1.246,0; 6 1.246,0.95
SI4362 = smd 0.837 x 0.264: 1 -1.937,1; 2 -1.937,0.5; 3 -1.937,0; 4 -1.937,-0.5; 5 -1.937,-1; 11 1.937,-1; 12 1.937,-0.5; 13 1.937,0; 14 1.937,0.5; 15 1.937,1 | smd 0.264 x 0.837: 6 -1,-1.937; 7 -0.5,-1.937; 8 0,-1.937; 9 0.5,-1.937; 10 1,-1.937; 16 1,1.937; 17 0.5,1.937; 18 0,1.937; 19 -0.5,1.937; 20 -1,1.937 | smd 2.6 x 2.6: 21 0,0
PCAL6416 = smd 0.86 x 0.27: 1 -1.935,1.25; 2 -1.935,0.75; 3 -1.935,0.25; 4 -1.935,-0.25; 5 -1.935,-0.75; 6 -1.935,-1.25; 13 1.935,-1.25; 14 1.935,-0.75; 15 1.935,-0.25; 16 1.935,0.25; 17 1.935,0.75; 18 1.935,1.25 | smd 0.27 x 0.86: 7 -1.25,-1.935; 8 -0.75,-1.935; 9 -0.25,-1.935; 10 0.25,-1.935; 11 0.75,-1.935; 12 1.25,-1.935; 19 1.25,1.935; 20 0.75,1.935; 21 0.25,1.935; 22 -0.25,1.935; 23 -0.75,1.935; 24 -1.25,1.935 | smd 2 x 2: 25 0,0
M24 = smd 1.968 x 0.569: 1 -2.473,1.905; 2 -2.473,0.635; 3 -2.473,-0.635; 4 -2.473,-1.905; 5 2.473,-1.905; 6 2.473,-0.635; 7 2.473,0.635; 8 2.473,1.905
47L16 = smd 1.901 x 0.599: 1 -2.455,1.905; 2 -2.455,0.635; 3 -2.455,-0.635; 4 -2.455,-1.905; 5 2.455,-1.905; 6 2.455,-0.635; 7 2.455,0.635; 8 2.455,1.905
RH100 = smd 1.3 x 1.1: 1 -1.15,0.95; 2 -1.15,-0.95; 3 1.15,-0.95; 4 1.15,0.95
TC1-1T-152X+ = smd 1.65 x 0.76: 1 -1.59,-1.27; 2 -1.59,0; 3 -1.59,1.27; 4 1.59,1.27; 6 1.59,-1.27

### Placement (x,y rotation side)
A1  -25.4,50.8 90 top
AE1  93.98,0 270 top
BT1  50.8,7.62 0 bottom
BT2  50.8,93.98 180 bottom
C1  11.43,86.36 0 top
C2  20.32,82.55 180 top
C3  16.51,83.82 270 top
C4  15.24,77.47 270 top
C5  20.32,77.47 270 top
C6  24.13,80.01 180 top
C7  67.31,35.56 180 top
C8  59.69,38.1 270 top
C9  74.93,33.02 270 top
C10  90.17,30.48 180 top
C11  74.93,30.48 90 top
C12  69.85,33.02 270 top
C13  73.66,30.48 90 top
C14  58.42,64.77 180 top
C15  99.06,13.97 90 top
C16  99.06,16.51 270 top
C17  87.63,17.78 270 top
C18  92.71,20.07 180 top
C19  93.98,6.35 90 top
C20  55.88,50.8 180 top
C21  55.88,52.07 180 top
C22  8.89,66.04 90 top
C23  6.35,72.39 0 top
C24  69.85,48.26 180 top
C25  77.47,44.45 180 top
C26  90.17,78.74 180 top
C27  87.63,76.2 0 top
C28  87.63,80.01 0 top
C29  87.63,83.82 0 top
C30  87.63,87.63 0 top
C31  78.74,22.86 270 top
C32  87.63,38.1 0 top
C33  87.63,40.64 0 top
C34  87.63,45.72 0 top
C35  87.63,43.18 0 top
C36  10.16,82.55 180 top
C37  6.35,83.82 270 top
C38  5.08,77.47 270 top
C39  10.16,77.47 270 top
C40  13.97,80.01 180 top
C41  90.42,20.07 0 top
D1  83.82,77.47 180 top
D2  83.82,81.28 180 top
D3  83.82,85.09 180 top
D4  83.82,88.9 180 top
J1  81.28,43.18 0 bottom
J2  93.98,39.37 90 top
J3  96.52,76.2 0 bottom
J4  71.12,52.07 0 bottom
L1  20.32,80.01 0 top
L2  10.16,80.01 0 top
LS1  60.96,71.12 90 bottom
Q1  12.7,6.35 0 top
Q2  87.63,71.12 0 top
Q3  87.63,63.5 0 top
Q4  60.96,62.23 90 top
R1  12.7,3.81 0 top
R2  95.25,91.44 180 top
R3  16.51,81.28 270 top
R4  19.05,73.66 0 top
R5  16.51,73.66 0 top
R6  67.31,34.29 180 top
R7  77.47,45.72 180 top
R8  90.17,80.01 180 top
R9  82.55,72.39 180 top
R10  87.63,29.21 0 top
R11  87.63,31.75 0 top
R12  82.55,64.77 180 top
R13  58.42,63.5 180 top
R14  72.39,35.56 180 top
R15  90.17,46.99 0 top
R16  87.63,46.99 0 top
R17  90.17,41.91 0 top
R18  87.63,41.91 0 top
R19  90.17,44.45 0 top
R20  87.63,44.45 0 top
R21  90.17,39.37 0 top
R22  87.63,39.37 0 top
R23  77.47,20.32 270 top
R24  77.47,22.86 270 top
R25  87.63,77.47 180 top
R26  83.82,76.2 0 top
R27  87.63,81.28 180 top
R28  83.82,80.01 0 top
R29  87.63,85.09 180 top
R30  83.82,83.82 0 top
R31  87.63,88.9 180 top
R32  83.82,87.63 0 top
R33  92.71,13.97 0 top
R34  54.61,48.26 180 top
R35  54.61,53.34 0 top
R36  8.89,62.23 90 top
R37  8.89,29.21 90 top
R38  8.89,33.02 90 top
R39  69.85,45.72 180 top
R40  58.42,45.72 0 top
R41  58.42,46.99 0 top
R42  58.42,48.26 180 top
R43  69.85,46.99 0 top
R44  87.63,52.07 180 top
R45  57.15,33.02 0 top
R46  57.15,34.29 0 top
R47  8.89,71.12 0 top
R48  8.89,72.39 0 top
R49  12.7,82.55 270 top
R50  13.97,83.82 90 top
R51  50.8,93.98 180 top
R52  6.35,81.28 270 top
R53  8.89,73.66 0 top
R54  6.35,73.66 0 top
R55  77.47,46.99 180 top
RV1  12.7,66.04 180 top
RV2  90.17,67.31 180 top
RV3  12.7,91.44 270 top
RV4  90.17,36.83 0 top
RV5  90.17,57.15 0 top
RV6  90.17,54.61 0 top
RV7  90.17,52.07 0 top
RV8  90.17,49.53 0 top
S1  99.06,91.44 270 top
S2  30.48,81.28 0 top
S3  50.8,81.28 0 top
S4  71.12,81.28 0 top
S5  30.48,60.96 0 top
S6  50.8,60.96 0 top
S7  71.12,60.96 0 top
S8  30.48,40.64 0 top
S9  50.8,40.64 0 top
S10  71.12,40.64 0 top
S11  30.48,20.32 0 top
S12  50.8,20.32 0 top
S13  71.12,20.32 0 top
U1  17.78,77.47 270 top
U2  81.28,30.48 180 top
U3  72.39,33.02 180 top
U4  95.25,16.51 90 top
U5  50.8,50.8 270 top
U6  63.5,46.99 0 top
U7  62.23,33.02 0 top
U8  7.62,77.47 270 top
XTAL1  90.17,17.78 0 top
Z1  95.25,10.16 270 top

### Tracks (layer width: path | path; a pad name or v marks a point on that pad's centre or on a via)
!RESET  (via drill 0.2)
  Top 0.254: U2.29 81.68,28.68 v81.53,28.83 | R55.P$1 80.9,46.99 v81.15,46.74
  Bottom 0.254: v81.15,46.74 81.25,46.84 83.5,46.84 83.67,46.67 83.67,42.72 82.55,41.6 J1.5 83.5,40.64 84.91,39.23 84.91,38.75 83.94,37.78 83.94,35.3 83.8,35.15 83.8,32.17 81.53,29.91 v81.53,28.83
!SLAVE_RAW_RESET
  Top 0.254: J3.5 97.66,73.53 97.66,49.04 98.34,48.36 99.12,48.36 100,47.48 100,43.08 J2.19 93.75,36.83 RV4.P$2
  Bottom 0.254: J2.19 97.46,43.28 93.49,43.28 92.81,43.96 92.81,45.93 92.4,46.34 92.4,48.3 91.99,48.71 91.99,49.79 91.59,50.2 91.59,53.06 91.99,53.47 91.99,55.43 92.4,55.84 92.4,57.8 93.98,59.39 J2.9
!SLAVE_RESET
  Top 0.254: U2.12 81.68,35.96 82.28,36.56 83.52,36.56 84.39,35.69 86.76,35.69 87.91,36.83 RV4.P$1
+3V
  Top 0.254: U2.20 75.28,30.88 C11.P$2 C13.P$2 73.64,31.25 U3.1
+3V3  (via drill 0.2)
  Top 0.254: C22.P$2 9.64,67.54 R47.P$2 17.26,71.12 R4.P$2 22.23,76.08 22.23,80.01 L1.P$2 C6.P$2 23.18,80.94 26.8,84.56 60.96,84.56 | C22.P$2 7.37,66.79 A1.P2 6.07,65.49 6.07,63.55 | C22.P$2 12.65,66.79 RV1.1 | R36.P$2 7.56,62.98 7.53,62.95 6.67,62.95 6.07,63.55 | 5.48,29.93 4.8,30.61 4.8,62.29 6.07,63.55 | R37.P$2 8.86,29.93 5.48,29.93 | U4.6 98.27,15.51 C15.P$2 99.06,15.62 | 99.06,15.62 C16.P$2 98.31,16.51 U4.8 | U2.18 75.82,32.48 | 75.82,32.48 75.14,32.48 C9.P$2 | U3.6 70.94,32.27 C12.P$2 | C25.P$2 R7.P$2 R55.P$2 76.72,47.74 v76.45,48.01 | U5.21 54.88,50.55 C20.P$2 C21.P$2 | C21.P$2 55.13,53.11 R35.P$2 55.49,53.47 v57.02,53.47 58.42,52.07 58.42,51.69 v57.4,50.67 | C27.P$2 88.03,76.2 87.3,75.47 85.3,75.47 R26.P$2 | C28.P$2 88.03,80.01 87.3,79.28 85.3,79.28 R28.P$2 | C29.P$2 88.03,83.82 87.3,83.09 85.3,83.09 R30.P$2 | C30.P$2 88.03,87.63 87.3,86.9 85.3,86.9 R32.P$2 | C30.P$2 R31.P$1 87.45,89.83 82.4,89.83 77.13,84.56 60.96,84.56 | C30.P$2 R29.P$1 C29.P$2 | C29.P$2 R27.P$1 C28.P$2 | C28.P$2 R25.P$1 C27.P$2 | C21.P$2 55,52.2 53.76,52.2 53.12,51.55 U5.23 | U6.8 68.47,48.9 C24.P$2 69.33,48.26 R43.P$2 | U7.8 65.92,34.92 C7.P$2 | C27.P$2 88.38,68.35 RV2.P$2 | 60.96,84.56 LS1.2 57.67,71.08 C14.P$2 R13.P$2 57.67,57.42 v57.02,56.77 | v57.02,49.02 57.67,48.38 R42.P$2 58.59,47.34 58.59,45.15 62.64,41.1 62.64,31.4 63.5,30.54 65.75,30.54 67.14,31.92 67.14,34.98 C7.P$2 | C7.P$2 66.56,43.04 68.51,44.99 69.52,44.99 69.68,45.15 69.68,46.07 R43.P$2 | R43.P$2 73.79,46.99 v74.8,48.01 | 5.48,29.93 5.48,28.58 6.67,27.39 8.5,27.39 9.21,26.67 9.21,20.57 13.55,16.22 70.77,16.22 v71.12,15.88 | v71.12,17.65 v71.12,22.99
  Top 0.254: U3.6 71.12,32.05 v71.12,24.64 73.41,24.64 v74.93,26.16 | U3.6 72.08,32.07 72.39,32.38 72.39,34.04 73.03,34.67 74.1,34.67 74.99,35.56 76.2,35.56 76.45,35.31 76.45,34.29 75.82,33.66 75.82,32.48 | 89.42,29.77 90.25,28.94 90.25,28.63 v90.42,28.45 v96.52,28.45 | 89.42,29.77 89.39,29.79 88.91,29.79 88.57,29.45 88.57,29.4 R10.P$2 87.51,30.08 U2.4 | v98.55,28.45 99.79,27.21 99.79,16.35 99.06,15.62 | 89.42,29.77 C10.P$2 88.38,31.52 R11.P$2
  Bottom 0.254: v57.02,56.77 v57.02,53.47 | v57.02,49.02 57.4,49.4 v57.4,50.67 | v74.8,48.01 v76.45,48.01 | v71.12,15.88 v71.12,17.65 | v71.12,22.99 v71.12,24.64 | v74.93,26.16 75.41,25.68 75.41,25.3 76.3,24.41 77.94,24.41 79.57,22.79 80.38,22.79 81.22,23.62 84.96,23.62 85.95,22.63 86.77,22.63 88.57,24.43 88.57,26.53 90.25,28.21 90.25,28.27 v90.42,28.45 | v96.52,28.45 v98.55,28.45
+5V
  Top 0.254: L2.P$2 12.06,80.01 | 12.06,80.01 C40.P$2 12.7,80.33 R49.P$2 | 12.06,80.01 12.06,76.08 R53.P$2 R48.P$2
+7V4V
  Top 0.254: R2.P$2 77.14,91.44 75.49,89.79 74.12,89.79 70.84,93.07 30.76,93.07 26.52,88.83 RV3.P$2 5.13,88.83 2.56,86.26 2.56,14.22 9.52,7.26 | Q1.1 9.52,7.26 | U8.3 7.29,80.64 C36.P$2 9.21,83.39 12.1,86.28 | C1.P$2 R50.P$2 | R23.P$2 77.47,15.16 73.15,10.84 73.15,4.72 71,2.56 11.3,2.56 9.52,4.35 9.52,7.26
  Top 1.27: RV3.P$2 12.7,86.88 C1.P$2 12.1,86.28
BAT_DETECT
  Top 0.254: C31.P$2 R24.P$2 | R24.P$2 76.74,22.84 76.74,24.57 U2.25 | R24.P$2 R23.P$1
BTN0
  Top 0.254: U5.10 48.26,50.55 33.73,65.08 S2.4 S2.3
BTN1
  Top 0.254: U5.8 48.33,51.55 47.85,52.03 47.85,53.15 53.02,58.31 53.02,78 S3.4 S3.3
BTN2
  Top 0.254: U5.6 49.55,53.69 51.96,56.1 71.19,56.1 73.34,58.25 73.34,78 S4.4 S4.3
BTN3
  Top 0.254: U5.11 48.18,50.05 39.52,58.71 S5.4 S5.3
BTN4
  Top 0.254: U5.7 48.41,52.05 48.26,52.2 48.26,52.98 53.99,58.71 S6.4 S6.3
BTN5
  Top 0.254: U5.5 50.05,53.62 52.13,55.7 71.36,55.7 S7.4 S7.3
BTN6
  Top 0.254: U5.12 40.39,49.55 S8.3 S8.4
BTN7
  Top 0.254: U5.15 50.55,46.42 54.05,42.92 S9.3 S9.4
BTN8
  Top 0.254: U5.17 51.55,47.43 55.05,43.92 56.13,43.92 56.17,43.89 56.25,43.89 56.59,43.55 56.59,43.07 55.9,42.37 55.9,35.94 56.98,34.86 56.98,30.78 58.29,29.46 67.31,29.46 69.12,31.27 69.12,35.87 70.61,37.36 73.34,37.36 S10.4 S10.3
BTN9
  Top 0.254: U5.13 49.55,46.35 33.73,30.53 S11.3 S11.4
BTN10
  Top 0.254: U5.14 50.05,46.34 53.02,43.38 53.02,23.6 S12.3 S12.4
BTN11
  Top 0.254: U5.16 51.05,47.35 55.08,43.32 55.08,27.72 59.2,23.6 73.34,23.6 S13.3 S13.4
BUZZER  (via drill 0.2)
  Top 0.254: v82.17,33.02 82.25,33.02 83.28,34.05 U2.10 | v76.07,42.16 76.07,43.38 75.44,44.01 v75.44,49.02 | v75.44,50.67 75.44,53.03 74.8,53.66 65.6,53.66 v65.41,53.47 | v65.41,56.77 61.09,56.77 60.01,57.85 Q4.1
  Bottom 0.254: v82.17,33.02 81.79,33.4 81.79,39.75 81.13,40.41 81.13,41.1 80.17,42.06 76.17,42.06 v76.07,42.16 | v75.44,49.02 v75.44,50.67 | v65.41,53.47 v65.41,56.77
DAQ_CS  (via drill 0.2)
  Top 0.254: U4.15 94.25,23.86 93.6,24.51 v86.36,24.51 | v84.07,29.21 83.89,29.39 83.83,29.39 80.08,33.14 U2.14
  Bottom 0.254: v84.07,29.21 84.25,29.03 85.65,29.03 87.35,27.33 87.35,25.57 86.36,24.58 v86.36,24.51
DAQ_GPIO0
  Top 0.254: U4.9 97.66,17.01 97.92,17.27 97.92,31.88 96.51,33.28 U2.8
DAQ_GPIO1
  Top 0.254: U4.10 97.19,31.46 96.17,32.48 86.49,32.48 | U2.7 86.49,32.48 | 86.49,32.48
DAQ_GPIO2
  Top 0.254: U4.19 92.09,16.01 92.09,16 80.52,16 79.47,17.05 79.47,19.56 80.14,20.23 80.14,22.54 79.47,23.21 79.47,24.16 79.25,24.38 79.25,26.28 U2.26
DAQ_GPIO3  (via drill 0.2)
  Top 0.254: v86.36,16.64 v86.36,23.62 | v86.36,15.37 86.5,15.51 U4.20 | v84.07,29.97 81.53,32.51 81.53,33.38 81.79,33.64 82.07,33.64 82.48,34.05 U2.11
  Bottom 0.254: v84.07,29.97 84.25,29.79 85.47,29.79 87.75,27.5 87.75,25.08 86.36,23.69 v86.36,23.62 | v86.36,16.64 v86.36,15.37
DAQ_IRQ
  Top 0.254: U4.11 96.25,26.43 95.01,27.67 85.61,27.67 85.6,27.68 U2.1
EXP_IRQ  (via drill 0.2)
  Top 0.254: v80.14,23.37 82.23,23.37 84.08,25.22 U2.32 | U5.22 53.72,51.05 v54.1,51.44 | v54.61,49.02 54.44,48.85 54.44,46.15 v56.01,44.58 | v56.01,43.31 55.49,42.79 55.49,27.89 59.37,24.01 73.67,24.01 v75.82,26.16
  Bottom 0.254: v80.14,23.37 79.88,23.62 79.31,23.62 78.11,24.82 76.47,24.82 75.82,25.46 v75.82,26.16 | v56.01,43.31 v56.01,44.58 | v54.1,51.44 54.1,49.53 v54.61,49.02
GND  (via drill 0.2)  (2 unrouted)
  other vias: 5.21,84.58 11.56,81.28 14.99,81.41 17.65,84.96 22.35,82.55 25.15,81.41 17.78,77.47 7.62,77.47 5.08,79.25 14.73,73.66 4.7,73.03 11.68,69.22 10.03,65.28 8.89,31.24 10.92,4.32 14.73,86.61 8.13,87.88 11.81,84.96 35.81,60.58 56.77,75.56 76.83,70.87 92.33,69.22 89.15,68.58 78.36,52.07 60.96,52.07 67.31,50.93 64.52,43.56 64.77,38.73 67.94,46.1 50.8,50.8 52.83,47.75 56.39,48.26 57.53,51.94 61.34,44.07 56.64,46.23 71.63,45.72 71.75,48.26 58.17,31.11 56.26,31.88 68.33,33.15 67.94,36.7 69.98,34.92 74.17,35.56 74.17,28.57 75.44,34.8 72.64,20.32 82.93,19.81 78.87,21.21 85.09,25.27 93.47,21.34 87.63,19.68 95.25,16.51 90.93,13.97 95.25,10.16 97.66,8.64 96.65,5.97 91.57,5.84 99.06,12.19 98.93,18.54 84.96,63.25 84.84,68.83 94.11,64.26 87,30.73 92.08,30.61 84.07,30.86 85.72,76.45 85.72,80.26 85.72,84.07 85.72,87.88 85.85,37.21
  pour Top: 0,0 0,101.6 7.62,101.6 101.6,101.6 101.6,53.34 101.6,0
  pour Bottom: 0,0 0,101.6 27.94,101.6 101.6,101.6 101.6,30.48 101.6,0
LCD_SCLK  (via drill 0.2)
  Top 0.254: U2.2 85.48,28.45 87.07,28.45 87.44,28.07 89.29,28.07 v89.66,28.45 | v76.71,25.4 76.33,25.03 76.33,24.38 76.33,24.26 76.33,18 74.97,16.63 13.72,16.63 9.62,20.73 9.62,53.84 A1.P6
  Bottom 0.254: v76.71,25.4 78.1,25.4 79.47,24.03 85.13,24.03 86.12,23.04 86.6,23.04 88.16,24.6 88.16,26.95 v89.66,28.45
LCD_SID  (via drill 0.2)
  Top 0.254: U2.31 83.28,25.24 v83.06,25.02 | v76.71,26.16 76.53,25.98 76.47,25.98 75.93,25.44 75.93,18.17 74.8,17.04 27.3,17.04 27.05,17.04 13.89,17.04 10.03,20.9 10.03,55.97 A1.P5
  Bottom 0.254: v76.71,26.16 77.92,26.16 79.64,24.44 82.47,24.44 v83.06,25.02
LED0
  Top 0.254: U5.1 52.05,53.32 52.8,54.07 78.29,54.07 80.81,56.6 80.81,75.42 D1.P$2 82.87,76.4 R26.P$1
LED1
  Top 0.254: U5.2 51.55,53.4 52.63,54.48 53.59,54.48 53.72,54.48 78.12,54.48 80.41,56.76 80.41,78.82 D2.P$2 82.87,80.21 R28.P$1
LED2
  Top 0.254: U5.3 51.05,53.47 52.46,54.88 77.95,54.88 80,56.93 80,82.22 D3.P$2 82.87,84.02 R30.P$1
LED3
  Top 0.254: U5.4 50.55,53.54 52.29,55.29 53.09,55.29 53.47,55.29 77.78,55.29 79.59,57.1 79.59,85.5 82.87,88.77 | R32.P$1 82.87,87.83 82.87,88.77 | 82.87,88.77 D4.P$2
MISO  (via drill 0.2)
  Top 0.254: U4.13 95.25,25.27 94.36,26.16 v86.36,26.16 | v83.31,27.69 83.31,28.57 78.48,33.41 U2.16 78.48,43.23 79.55,44.3 81.13,44.3 J1.1 82.55,47.74 R44.P$2
  Bottom 0.254: v83.31,27.69 83.13,27.86 83.13,27.93 82.79,28.27 82.31,28.27 81.97,27.93 81.97,27.45 83.25,26.16 v86.36,26.16
MOSI  (via drill 0.2)
  Top 0.254: J1.4 78.89,42.06 78.89,40.18 79.28,39.79 U2.15 79.28,33.18 83.83,28.63 83.89,28.63 v84.07,28.45 | U4.14 94.75,24.51 93.86,25.4 v86.36,25.4
  Bottom 0.254: v86.36,25.4 86.54,25.58 86.6,25.58 86.94,25.92 86.94,27.16 85.66,28.45 v84.07,28.45
N$1
  Top 1.27: BT1.-1 26.8,7.62 | 26.8,7.62 BT1.-2 | BT1.-3 26.8,7.62 | BT1.-3 17.91,6.35 Q1.3 13.45,6.03 R1.P$2 | C1.P$1 3.96,86.36 3.48,85.88 3.48,14.6 9.72,8.36 18.44,8.36 BT1.-3
N$2
  Top 0.254: Q3.4 90.92,65.31 RV2.P$1
N$3
  Top 0.254: U1.4 16.8,80.23 R3.P$2
N$4
  Top 1.27: BT1.+1 74.8,7.62 | 74.8,7.62 BT1.+2 71.37,1.65 2.54,1.65 1.65,2.54 1.65,99.06 2.54,99.95 71.37,99.95 BT2.-2 74.8,93.98 | BT1.+3 74.8,7.62 | 74.8,93.98 BT2.-1 | BT2.-3 74.8,93.98 | R51.P$1 74.8,93.98
N$5
  Top 0.254: C3.P$2 R3.P$1
N$6
  Top 0.254: U1.5 15.93,76.03 C4.P$2
N$7
  Top 0.254: C5.P$2 19.44,76.72 U1.8
N$8
  Top 0.254: U1.2 18.11,79.7 18.41,80.01 L1.P$1 19.37,79.17 C5.P$1
N$9
  Top 0.254: R4.P$1 R5.P$2 17.45,73.86 U1.6
N$10
  Top 0.254: R2.P$1 S1.2
N$11
  Top 0.254: U6.1 59.8,48.9 R42.P$1
N$12
  Top 0.254: U3.4 71.14,35.06 R14.P$2
N$13
  Top 0.254: R27.P$2 D2.P$1
N$14
  Top 0.254: C25.P$1 R7.P$1 J1.2
N$15
  Top 0.254: D3.P$1 R29.P$2
N$16
  Top 0.254: D1.P$1 R25.P$2
N$17
  Top 0.254: R31.P$2 D4.P$1
N$18
  Top 0.254: R33.P$2 94.06,14.57 U4.1
N$19
  Top 0.254: R8.P$1 C26.P$1 J3.2
N$20
  Top 0.254: R12.P$1 Q3.1
N$21
  Top 0.254: AE1.CENTER C19.1
N$22
  Top 0.254: R36.P$1 8.85,61.44 A1.P4
N$23
  Top 0.254: U4.17 92.84,17.01 92.2,17.66 90.17,17.66 | 90.17,17.66 89.85,17.66 XTAL1.2 88.82,17.03 C17.P$2 | 90.17,17.66 90.17,19.57 C41.P$1
N$24
  Top 0.254: U4.3 95.25,13.46 96.52,12.19 Z1.3
N$25
  Top 0.254: U4.2 94.75,13.47 93.98,12.7 Z1.1
N$26
  Top 0.254: R9.P$1 Q2.1
N$27
  Top 0.254: LS1.1 Q4.3 60.69,63.5 R13.P$1
N$28
  Top 0.254: U4.16 92.92,17.51 91.7,18.73 XTAL1.4 91.17,18.88 C41.P$2 C18.P$2
N$29
  Top 0.254: C19.2 Z1.6
N$30
  Top 0.254: U5.24 52.73,52.22 R35.P$1
N$31
  Top 0.254: R37.P$1 7.14,28.46 A1.P17
N$32
  Top 0.254: R34.P$2 53.26,48.87 U5.18
N$33
  Top 0.254: R38.P$2 7.37,33.77 A1.P15
N$34
  Top 0.254: R39.P$2 69.1,46.86 | 69.1,46.86 R43.P$1 | U6.7 68.34,47.62 69.1,46.86
N$35
  Top 0.254: A1.P3 12.09,63.98 RV1.2
N$36
  Top 0.254: U6.3 59.8,46.35 R40.P$2
N$37
  Top 0.254: U6.2 59.8,47.62 R41.P$2
N$38
  Top 0.254: U7.7 65.92,33.66 R6.P$2
N$43
  Top 0.254: R47.P$1 R48.P$1 C23.P$2 7.1,71.62 6.6,71.12 5.03,71.12 4.39,70.48 4.39,24.05 5.11,23.34 A1.P19
N$44
  Top 0.254: U7.1 59.77,37.06 C8.P$2
N$45
  Top 0.254: U7.3 58.53,32.38 R45.P$2
N$46
  Top 0.254: U7.2 58.53,33.66 R46.P$2
N$50
  Top 0.254: U8.4 6.64,80.23 R52.P$2
N$51
  Top 0.254: R49.P$1 13.74,83.3 R50.P$1 14.21,83.31 15.61,83.31 15.94,83.65 18.27,83.65 C2.P$2 17.45,80.64 U1.3
N$52
  Top 0.254: R52.P$1 C37.P$2
N$53
  Top 0.254: C38.P$2 5.76,76.03 U8.5
N$54
  Top 0.254: U8.8 9.28,76.72 C39.P$2
N$55
  Top 0.254: U8.2 7.95,79.57 8.38,80.01 L2.P$1 9.21,79.17 C39.P$1
N$56
  Top 0.254: U8.6 7.29,73.86 R54.P$2 R53.P$1
N$58
  Top 1.27: BT2.+2 26.8,93.98 | 26.8,93.98 BT2.+1 | 26.8,93.98 BT2.+3 12.78,93.98 RV3.P$1 | R51.P$2 26.8,93.98
N$64
  Top 0.254: RV5.P$2 J2.8
  Bottom 0.254: J2.8 94.94,56.19 96.74,56.19 97.14,55.78 99.32,55.78 100.41,54.69 100.41,46.91 98.83,45.33 J2.18
PWR_EN
  Top 0.254: U8.7 7.95,75.49 8.13,75.31 9.9,75.31 10.89,76.3 10.89,78.83 10.48,79.25 10.48,83.31 11.15,83.99 14.62,83.99 19.05,88.42 20.7,88.42 | S1.3 97.79,90.71 94.08,90.71 93.76,91.03 77.31,91.03 75.66,89.38 73.95,89.38 70.67,92.66 30.93,92.66 26.68,88.42 20.7,88.42 | U1.7 18.11,75.49 18.29,75.31 20.06,75.31 21.05,76.3 21.05,78.83 20.64,79.25 20.64,88.36 20.7,88.42
SCL  (via drill 0.2)
  Top 0.254: R11.P$1 86.81,31.68 U2.6 84.27,31.68 v84.2,31.75 | U5.19 54.31,49.55 54.37,49.6 63.32,49.6 v63.63,49.91 | J4.2 71.12,49.66 | 71.12,49.66 76.57,49.66 77.47,48.77 v80.77,48.77 | 71.12,49.66 70.87,49.91 v64.9,49.91 64.71,49.72 64.71,46.67 65.02,46.35 U6.6 67.06,46.35 67.24,46.17 67.24,44.69 63.46,40.9 63.46,32.68 63.75,32.38 U7.6
  Bottom 0.254: v84.2,31.75 84.2,34.98 84.35,35.13 84.35,37.61 85.32,38.58 85.32,39.4 84.07,40.64 84.07,46.84 82.15,48.77 v80.77,48.77 | v63.63,49.91 v64.9,49.91
SCLK  (via drill 0.2)
  Top 0.254: v77.85,43.43 78.07,43.21 78.07,35.78 77.11,34.82 U2.17 78.03,33.28 82.55,28.76 v82.55,27.69 | v86.36,26.92 94.74,26.92 95.75,25.92 U4.12
  Bottom 0.254: v77.85,43.43 78.68,43.43 79.55,44.3 81.43,44.3 J1.3 | v82.55,27.69 82.73,27.51 82.73,27.45 83.25,26.92 v86.36,26.92
SDA  (via drill 0.2)
  Top 0.254: U2.3 86.81,29.28 R10.P$1 87.23,29.21 87.96,28.48 88.8,28.48 89.15,28.84 v89.15,29.21 | v80.77,49.53 77.28,49.53 76.74,50.07 72.77,50.07 72.15,50.69 72.15,52.5 71.55,53.1 69.61,53.1 J4.3 65.28,52.07 64.3,51.09 | 64.3,45.81 65.02,45.09 U6.5 | U5.20 53.86,50.05 53.88,50.07 62.96,50.07 63.99,51.09 64.3,51.09 | 64.3,45.81 64.3,51.09 | U7.5 63.5,31.11 63.05,31.57 63.05,44.55 64.3,45.81
  Bottom 0.254: v89.15,29.21 86.62,29.21 84.78,31.05 84.78,31.99 84.61,32.17 84.61,34.81 84.76,34.96 84.76,37.45 85.72,38.41 85.72,39.57 84.48,40.81 84.48,47.01 81.96,49.53 v80.77,49.53
SLAVE_3V3
  Top 0.254: R15.P$2 J2.4 95.15,48.16 95.15,60.18 94.47,60.86 93.69,60.86 92.32,62.23 Q3.3 89.38,63.23 89.38,66.12 90,66.74 90,68.84 89.38,69.47 89.38,78.7 C26.P$2 R8.P$2
  Bottom 0.254: J2.14 97.74,54.61 96.57,55.78 93.49,55.78 92.81,55.1 92.81,53.13 92.4,52.73 92.4,50.54 92.81,50.13 92.81,49.04 93.98,47.87 J2.4
SLAVE_3V3_AIN  (via drill 0.2)
  Top 0.254: R16.P$2 R15.P$1 | C34.P$2 R16.P$2 | U2.19 78.43,31.68 v78.49,31.62 | R16.P$2 88.38,47.21 87.46,48.13 86.3,48.13 85.89,47.72 85.89,39.54 84.73,38.38 80.87,38.38 80.39,38.86 v80.14,38.86
  Bottom 0.254: v78.49,31.62 78.49,37.21 v80.14,38.86
SLAVE_5V
  Top 0.254: R19.P$2 J2.3
  Bottom 0.254: J2.3 93.98,45.33 92.81,46.5 92.81,48.47 92.4,48.88 92.4,49.96 91.99,50.37 91.99,52.89 92.4,53.3 92.4,55.27 92.81,55.67 92.81,57.64 93.49,58.32 94.47,58.32 95.64,57.15 J2.13
SLAVE_5V_AIN  (via drill 0.2)
  Top 0.254: R19.P$1 R20.P$2 88.38,44.32 | C35.P$2 88.38,44.32 | U2.22 78.3,29.28 v78.49,29.46 | 88.38,44.32 87.59,45.12 87.59,47.43 87.3,47.72 86.46,47.72 86.3,47.56 86.3,39.37 84.9,37.97 v80.14,37.97
  Bottom 0.254: v78.49,29.46 79.07,30.05 79.07,36.91 v80.14,37.97
SLAVE_9V
  Top 0.254: R17.P$2 J2.2 95.56,43.49 95.56,64.67 Q2.3
  Bottom 0.254: J2.12 95.64,59.69 94.47,60.86 93.49,60.86 92.81,60.18 92.81,58.79 91.99,57.97 91.99,56.01 91.59,55.6 91.59,53.64 91.18,53.23 91.18,50.03 91.59,49.62 91.59,48.54 91.99,48.13 91.99,46.17 92.4,45.76 92.4,43.49 J2.2
SLAVE_9V_AIN  (via drill 0.2)
  Top 0.254: R17.P$1 R18.P$2 C33.P$2 87.63,39.89 87.63,37.7 86.42,36.5 84.73,36.5 83.86,37.37 80.42,37.37 v80.14,37.08 | U2.23 78.39,28.48 v78.49,28.57
  Bottom 0.254: v80.14,37.08 80.14,37.02 79.55,36.44 79.55,29.64 v78.49,28.57
SLAVE_BUZZER  (via drill 0.2)
  Top 0.254: U2.9 84.08,35.43 83.57,35.94 v82.55,35.94 | v82.8,38.99 82.98,39.17 82.98,39.23 84.67,40.92 84.67,48.23 87.8,51.35 87.8,55.53 RV5.P$1
  Bottom 0.254: v82.55,35.94 82.55,38.73 v82.8,38.99
SLAVE_MISO
  Top 0.254: R44.P$1 RV7.P$1
SLAVE_RAW_MISO
  Top 0.254: RV7.P$2 J2.6 | J2.16 100.41,51.11 100.41,76.12 J3.1
  Bottom 0.254: J2.6 96.29,52.07 J2.16
SLAVE_RAW_SCL
  Top 0.254: RV8.P$2 J2.5 | J2.15 100,53.24 100,73.99 J3.3
  Bottom 0.254: J2.5 92.81,50.7 92.81,52.56 93.49,53.24 97.66,53.24 J2.15
SLAVE_RAW_SDA
  Top 0.254: RV6.P$2 J2.7 | J2.17 97.25,48.57 97.25,72.62 96.67,73.2 96.67,74.78 J3.4
  Bottom 0.254: J2.17 98.83,47.87 100,49.04 100,52.56 99.12,53.44 98.04,53.44 96.86,54.61 J2.7
SLAVE_RLY_3V3  (via drill 0.2)
  Top 0.254: U2.13 80.88,36.05 v81.03,36.2 | v77.34,39.37 77.34,43.12 77.27,43.19 77.27,43.67 77.64,44.05 77.64,47.56 77.8,47.72 81.28,47.72 81.8,48.24 R12.P$2
  Bottom 0.254: v81.03,36.2 81.03,38.8 80.38,39.45 77.42,39.45 v77.34,39.37
SLAVE_RLY_9V  (via drill 0.2)
  Top 0.254: U2.30 82.48,25.33 82.17,25.02 v79.88,25.02 | v77.34,36.2 76.76,36.78 76.76,43.26 75.84,44.18 75.84,48.6 76.17,48.92 76.74,48.92 77.3,48.36 80.35,48.36 80.59,48.13 81.11,48.13 81.39,48.41 81.39,64.03 81.22,64.2 81.22,65.34 81.8,65.91 R9.P$2
  Bottom 0.254: v79.88,25.02 77.9,27 77.9,35.63 v77.34,36.2
SLAVE_SCL  (via drill 0.2)
  Top 0.254: U2.28 80.88,27.54 v80.9,27.56 | v84.33,38.99 85.49,40.15 85.49,47.89 87.12,49.53 RV8.P$1
  Bottom 0.254: v80.9,27.56 80.9,27.81 80.95,27.86 80.95,29.9 83.39,32.34 83.39,35.31 83.54,35.47 83.54,38.14 84.15,38.75 84.15,38.81 v84.33,38.99
SLAVE_SDA  (via drill 0.2)
  Top 0.254: U2.27 80.08,27.5 v80.14,27.56 | v83.57,38.99 83.75,39.17 83.75,39.23 85.08,40.57 85.08,48.06 88.36,51.34 89.84,51.34 90,51.5 90,54.03 RV6.P$1
  Bottom 0.254: v83.57,38.99 83.39,38.81 83.39,38.75 83.13,38.49 83.13,35.63 82.98,35.48 82.98,32.5 80.54,30.07 80.54,28.03 80.32,27.8 80.32,27.74 v80.14,27.56
SLAVE_VBAT
  Top 0.254: R21.P$2 J2.1 95.97,41.36 95.97,66.8 Q2.4
  Bottom 0.254: J2.11 95.64,62.23 94.47,63.4 93.49,63.4 92.81,62.72 92.81,60.75 92.4,60.34 92.4,58.95 91.59,58.14 91.59,56.18 91.18,55.77 91.18,53.8 90.77,53.4 90.77,49.86 91.18,49.46 91.18,48.37 91.59,47.96 91.59,46 91.99,45.59 91.99,43.32 92.81,42.51 92.81,40.54 J2.1
SLAVE_VBAT_AIN  (via drill 0.2)
  Top 0.254: R21.P$1 R22.P$2 C32.P$2 88.38,37.88 86.59,36.09 84.56,36.09 83.69,36.96 80.91,36.96 v80.14,36.2 | U2.24 v78.48,27.68 v78.49,27.69
  Bottom 0.254: v78.49,27.69 80.14,29.34 v80.14,36.2